# Altium project B108AA.PrjPcb (part 2 of 4)

## Sheet I2C Air Pressure Sensor.SchDoc: Air Pressure Sensor
size 292 x 193 mm; SheetNumber: 13; SheetTotal: 40
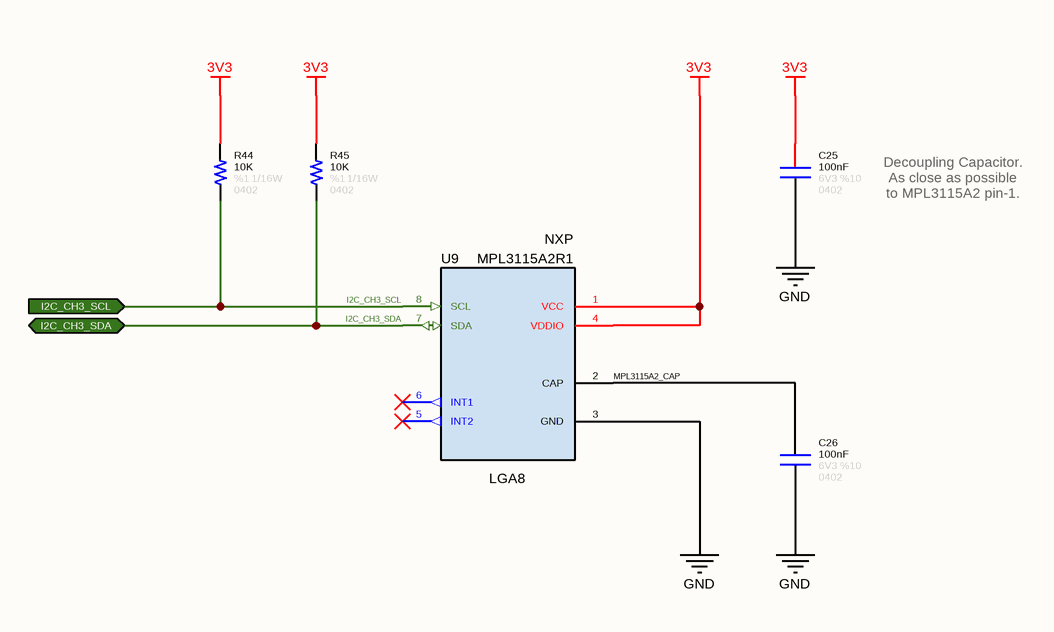
[diagram p12: I2C Air Pressure Sensor.SchDoc]

### Parts
C25  value 100nF  Tolerance: %10  Voltage: 6V3  Case: 0402  [CAPACITOR_0402]  (hidden comment: Capacitor - 100nF [0402] (Ceramic))
C26  value 100nF  Tolerance: %10  Voltage: 6V3  Case: 0402  [CAPACITOR_0402]  (hidden comment: Capacitor - 100nF [0402] (Ceramic))
R44  value 10K  Tolerance: %1  Case: 0402  Power: 1/16W  [RESISTOR_0402]  (hidden comment: 10K - 0402 - %1 - 1/16W)
R45  value 10K  Tolerance: %1  Case: 0402  Power: 1/16W  [RESISTOR_0402]  (hidden comment: 10K - 0402 - %1 - 1/16W)
U9  Manufacturer Name: NXP  Case: LGA8  [MPL3115A2]  (hidden comment: MPL3115A2R1)

### Ports
I2C_CH3_SCL (in), I2C_CH3_SDA (bidir)

### Nets
3V3: C25.2 R44.2 R45.2 U9.1(VCC) U9.4(VDDIO)
GND: C25.1 C26.1 U9.3(GND)
I2C_CH3_SCL: R44.1 U9.8(SCL) ; port I2C_CH3_SCL
I2C_CH3_SDA: R45.1 U9.7(SDA) ; port I2C_CH3_SDA
MPL3115A2_CAP: C26.2 U9.2(CAP)

Not connected (* = marked no-connect by the designer): U9 5(INT2)* 6(INT1)*

### Notes on the sheet
- Decoupling Capacitor. As close as possible to MPL3115A2 pin-1.
- © 2021 All rights reserved.
  This document may not, in whole or in part, be copied, photocopied, reproduced, translated or converted to any electronic or machine readable from without prior written permission of Mehmet Günce Akkoyun.
  Engineer contact : akkoyun@me.com
- Property of
- Engineer :
- Date :
- Size :
- A4
- Time :
- Project :
- Page :
- /
- Customer :
- Product ID :
- Module ID :
- Version :
- File :
- Revision :

### Library data of the parts
C25 C26 = Capacitor - 100nF [0402-6V3]: as C5 on sheet RS485 Channel 1; ComponentLink1Description: Mouser; ComponentLink1URL: https://www.mouser.com.tr/ProductDetail/AVX/04026D104KAT4A?qs=sGAEpiMZZMs0AnBnWHyRQPg4iYkCw7IMED%2F4kpqgf7w%3D; ComponentLink2Description: DataSheet; ComponentLink2URL: https://www.mouser.com.tr/datasheet/2/40/cx5r-776519.pdf
R44 R45 = Resistor - 10K [0402]: Thick Film Resistors - SMD 1/16 W 10 KOhm 1%; Manufacturer Name: Vishay; Manufacturer Part Number: CRCW040210K0FKED; ComponentLink1Description: DataSheet; ComponentLink1URL: https://www.mouser.com.tr/datasheet/2/427/dcrcwe3-1762152.pdf; ComponentLink2Description: Mouser; ComponentLink2URL: https://www.mouser.com.tr/ProductDetail/Vishay-Dale/CRCW040210K0FKED?qs=sGAEpiMZZMu61qfTUdNhG2DpbjADlD3GcalbOv9utCY%3D
U9 = IC - MPL3115A2R1: Board Mount Pressure Sensors; Operating Pressure: 20 kPa to 110 kPa; RoHS: Yes; Product Type: Absolute Pressure Sensors; Manufacturer Part Number: MPL3115A2R1

## Sheet I2C TH Sensor Socket.SchDoc: T/H Sensor Socket
size 292 x 193 mm; SheetNumber: 11; SheetTotal: 40
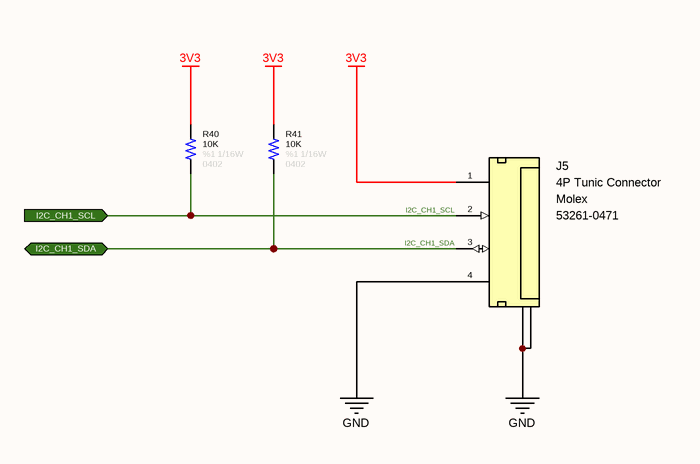
[diagram p13: I2C TH Sensor Socket.SchDoc]

### Parts
J5  Manufacturer Name: Molex  Manufacturer Part Number: 53261-0471  [Connector_Tunic 4P]  (hidden comment: 4P SMD Tunic Connector)
R40  value 10K  Tolerance: %1  Case: 0402  Power: 1/16W  [RESISTOR_0402]  (hidden comment: 10K - 0402 - %1 - 1/16W)
R41  value 10K  Tolerance: %1  Case: 0402  Power: 1/16W  [RESISTOR_0402]  (hidden comment: 10K - 0402 - %1 - 1/16W)

### Ports
I2C_CH1_SCL (in), I2C_CH1_SDA (bidir)

### Nets
3V3: J5.1(Pin-1) R40.2 R41.2
GND: J5.4(Pin-4) J5.5(GND) J5.6(GND)
I2C_CH1_SCL: J5.2(Pin-2) R40.1 ; port I2C_CH1_SCL
I2C_CH1_SDA: J5.3(Pin-3) R41.1 ; port I2C_CH1_SDA

### Notes on the sheet
- © 2021 All rights reserved.
  This document may not, in whole or in part, be copied, photocopied, reproduced, translated or converted to any electronic or machine readable from without prior written permission of Mehmet Günce Akkoyun.
  Engineer contact : akkoyun@me.com
- Property of
- Engineer :
- Date :
- Size :
- A4
- Time :
- Project :
- Page :
- /
- Customer :
- Product ID :
- Module ID :
- Version :
- File :
- Revision :
- (in symbol Connector - Mini Tunic 4P (1.25)) 4P Tunic Connector

### Library data of the parts
J5 = Connector - Mini Tunic 4P (1.25): Mini Tunic Connector with 4P; Pitch: 1.25mm; Position: 4; ROHS: Yes; ComponentLink1Description: DataSheet; ComponentLink1URL: https://www.mouser.com.tr/datasheet/2/276/0532610471_PCB_HEADERS-170942.pdf; ComponentLink2Description: Mouser; ComponentLink2URL: https://www.mouser.com.tr/ProductDetail/Molex/53261-0471?qs=%2Fha2pyFaduhLhIsk8tywtK7BwWtguBSP4XxyDBTOTfs%3D; Case: SMD; System: Connector
R40 R41 = Resistor - 10K [0402]: as R44 on sheet I2C Air Pressure Sensor; ComponentLink1Description: DataSheet; ComponentLink1URL: https://www.mouser.com.tr/datasheet/2/427/dcrcwe3-1762152.pdf; ComponentLink2Description: Mouser; ComponentLink2URL: https://www.mouser.com.tr/ProductDetail/Vishay-Dale/CRCW040210K0FKED?qs=sGAEpiMZZMu61qfTUdNhG2DpbjADlD3GcalbOv9utCY%3D

## Sheet I2C UV Sensor.SchDoc: UV Sensor
size 292 x 193 mm; SheetNumber: 12; SheetTotal: 40
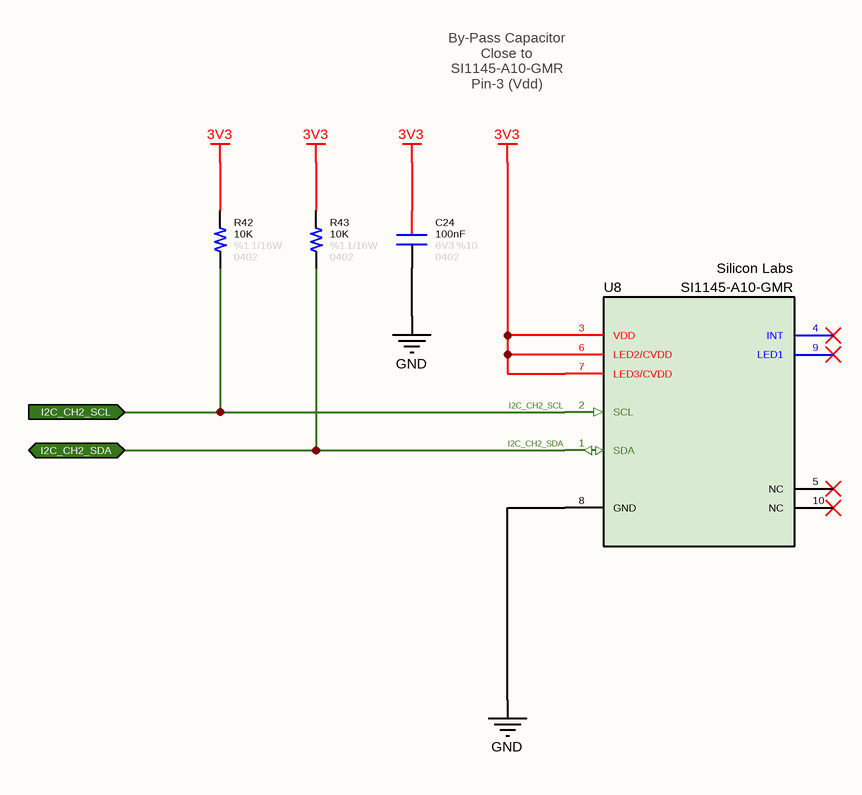
[diagram p14: I2C UV Sensor.SchDoc]

### Parts
C24  value 100nF  Tolerance: %10  Voltage: 6V3  Case: 0402  [CAPACITOR_0402]  (hidden comment: Capacitor - 100nF [0402] (Ceramic))
R42  value 10K  Tolerance: %1  Case: 0402  Power: 1/16W  [RESISTOR_0402]  (hidden comment: 10K - 0402 - %1 - 1/16W)
R43  value 10K  Tolerance: %1  Case: 0402  Power: 1/16W  [RESISTOR_0402]  (hidden comment: 10K - 0402 - %1 - 1/16W)
U8  Manufacturer Name: Silicon Labs  [SI1145]  (hidden comment: Si1145-A10-GMR)

### Ports
I2C_CH2_SCL (in), I2C_CH2_SDA (bidir)

### Nets
3V3: C24.2 R42.2 R43.2 U8.3(VDD) U8.6(LED2/CVDD) U8.7(LED3/CVDD)
GND: C24.1 U8.8(GND)
I2C_CH2_SCL: R42.1 U8.2(SCL) ; port I2C_CH2_SCL
I2C_CH2_SDA: R43.1 U8.1(SDA) ; port I2C_CH2_SDA

Not connected (* = marked no-connect by the designer): U8 4(INT)* 5(NC)* 9(LED1)* 10(NC)*

### Notes on the sheet
- By-Pass Capacitor
  Close to SI1145-A10-GMR
  Pin-3 (Vdd)
- © 2021 All rights reserved.
  This document may not, in whole or in part, be copied, photocopied, reproduced, translated or converted to any electronic or machine readable from without prior written permission of Mehmet Günce Akkoyun.
  Engineer contact : akkoyun@me.com
- Property of
- Engineer :
- Date :
- Size :
- A4
- Time :
- Project :
- Page :
- /
- Customer :
- Product ID :
- Module ID :
- Version :
- File :
- Revision :

### Library data of the parts
C24 = Capacitor - 100nF [0402-6V3]: as C5 on sheet RS485 Channel 1; ComponentLink1Description: Mouser; ComponentLink1URL: https://www.mouser.com.tr/ProductDetail/AVX/04026D104KAT4A?qs=sGAEpiMZZMs0AnBnWHyRQPg4iYkCw7IMED%2F4kpqgf7w%3D; ComponentLink2Description: DataSheet; ComponentLink2URL: https://www.mouser.com.tr/datasheet/2/40/cx5r-776519.pdf
R42 R43 = Resistor - 10K [0402]: as R44 on sheet I2C Air Pressure Sensor; ComponentLink1Description: DataSheet; ComponentLink1URL: https://www.mouser.com.tr/datasheet/2/427/dcrcwe3-1762152.pdf; ComponentLink2Description: Mouser; ComponentLink2URL: https://www.mouser.com.tr/ProductDetail/Vishay-Dale/CRCW040210K0FKED?qs=sGAEpiMZZMu61qfTUdNhG2DpbjADlD3GcalbOv9utCY%3D
U8 = IC - Si1145-A10-GMR: Proximity Sensors I2C UV Index and Proximity/Ambient Light Sensor with 1 LED Driver; Case: QFN-10; RoHS: Yes; Manufacturer Part Number: SI1145-A10-GMR

## Sheet I2C Serial ID.SchDoc: Serial ID
size 292 x 193 mm; SheetNumber: 10; SheetTotal: 40
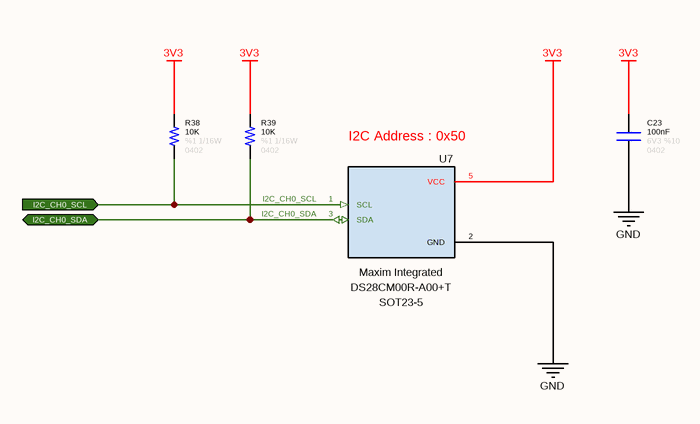
[diagram p15: I2C Serial ID.SchDoc]

### Parts
C23  value 100nF  Tolerance: %10  Voltage: 6V3  Case: 0402  [CAPACITOR_0402]  (hidden comment: Capacitor - 100nF [0402] (Ceramic))
R38  value 10K  Tolerance: %1  Case: 0402  Power: 1/16W  [RESISTOR_0402]  (hidden comment: 10K - 0402 - %1 - 1/16W)
R39  value 10K  Tolerance: %1  Case: 0402  Power: 1/16W  [RESISTOR_0402]  (hidden comment: 10K - 0402 - %1 - 1/16W)
U7  Manufacturer Name: Maxim Integrated  Case: SOT23-5  [SOT-23-5]  (hidden comment: DS28CM00R-A00+T)

### Ports
I2C_CH0_SCL (in), I2C_CH0_SDA (bidir)

### Nets
3V3: C23.2 R38.2 R39.2 U7.5(VCC)
GND: C23.1 U7.2(GND)
I2C_CH0_SCL: R38.1 U7.1(SCL) ; port I2C_CH0_SCL
I2C_CH0_SDA: R39.1 U7.3(SDA) ; port I2C_CH0_SDA

Not connected (* = marked no-connect by the designer): U7 4(NC)

### Notes on the sheet
- (near U7) I2C Address : 0x50
- © 2021 All rights reserved.
  This document may not, in whole or in part, be copied, photocopied, reproduced, translated or converted to any electronic or machine readable from without prior written permission of Mehmet Günce Akkoyun.
  Engineer contact : akkoyun@me.com
- Property of
- Engineer :
- Date :
- Size :
- A4
- Time :
- Project :
- Page :
- /
- Customer :
- Product ID :
- Module ID :
- Version :
- File :
- Revision :

### Library data of the parts
C23 = Capacitor - 100nF [0402-6V3]: as C5 on sheet RS485 Channel 1; ComponentLink1Description: Mouser; ComponentLink1URL: https://www.mouser.com.tr/ProductDetail/AVX/04026D104KAT4A?qs=sGAEpiMZZMs0AnBnWHyRQPg4iYkCw7IMED%2F4kpqgf7w%3D; ComponentLink2Description: DataSheet; ComponentLink2URL: https://www.mouser.com.tr/datasheet/2/40/cx5r-776519.pdf
R38 R39 = Resistor - 10K [0402]: as R44 on sheet I2C Air Pressure Sensor; ComponentLink1Description: DataSheet; ComponentLink1URL: https://www.mouser.com.tr/datasheet/2/427/dcrcwe3-1762152.pdf; ComponentLink2Description: Mouser; ComponentLink2URL: https://www.mouser.com.tr/ProductDetail/Vishay-Dale/CRCW040210K0FKED?qs=sGAEpiMZZMu61qfTUdNhG2DpbjADlD3GcalbOv9utCY%3D
U7 = IC - DS28C: Security ICs / Authentication ICs I C/SMBus Silicon Serial Number; Data Bus Width: 64 bit; RoHS: Yes; Product Type: Security ICs; Manufacturer Part Number: DS28CM00R-A00+T

## Sheet Power Architechture.SchDoc: Power Block Diagram
size 292 x 193 mm; SheetNumber: 2; SheetTotal: 40
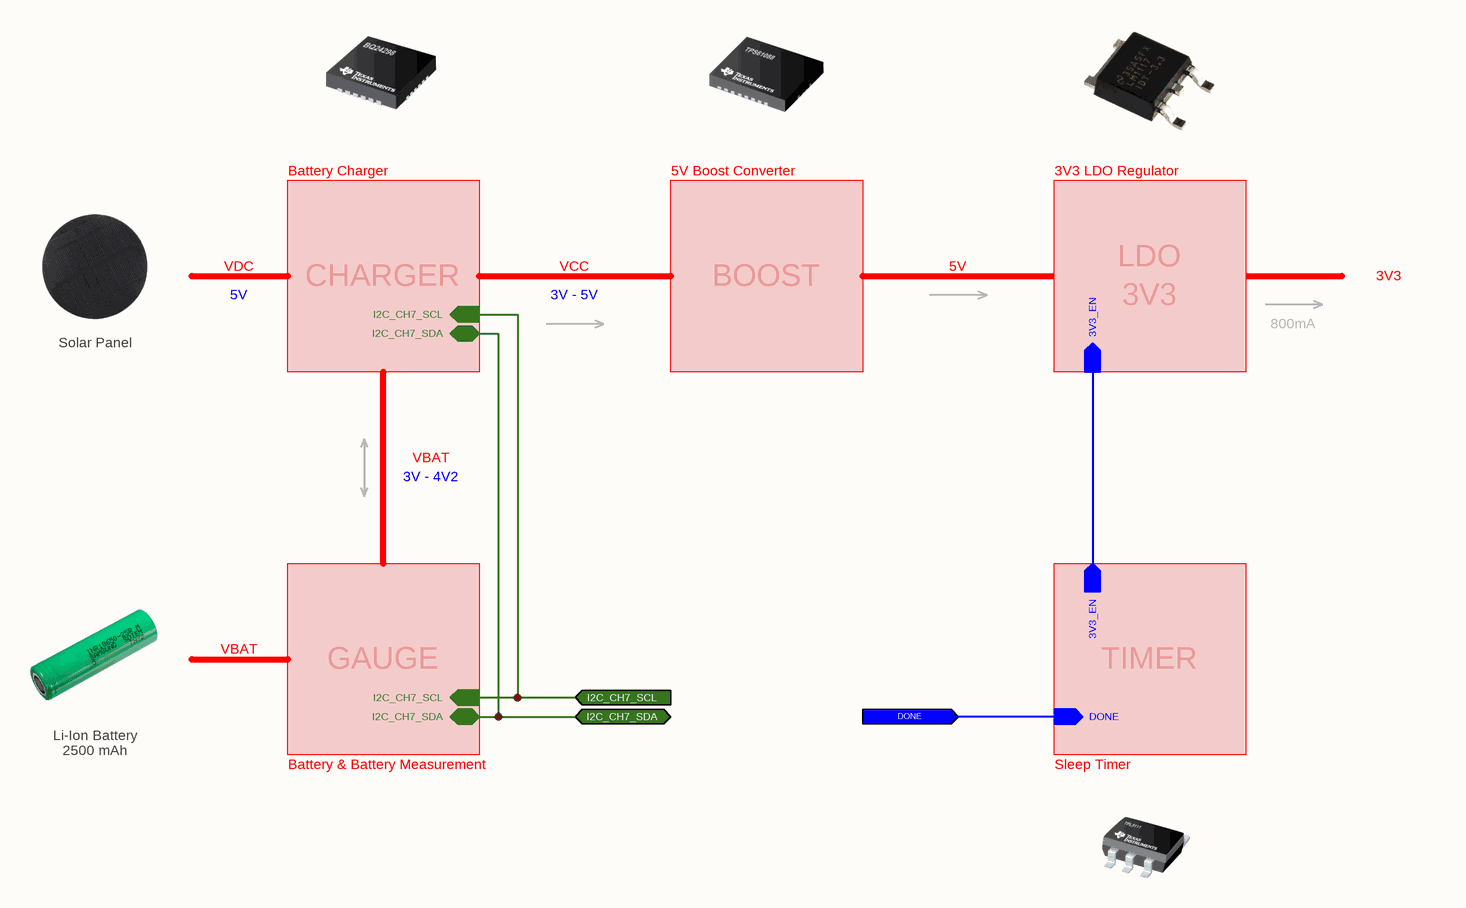
[diagram p16: Power Architechture.SchDoc]

### Sub-sheets
3V3 LDO Regulator = Power 3V3 Regulator.SchDoc: 3V3_EN (in)
5V Boost Converter = Power 5V Boost Converter.SchDoc: no entries
Battery & Battery Measurement = Power Battery Measurement.SchDoc: I2C_CH7_SCL (in), I2C_CH7_SDA (bidir)
Battery Charger = Power Battery Charger.SchDoc: I2C_CH7_SDA (bidir), I2C_CH7_SCL (in)
Sleep Timer = Power Sleep Timer.SchDoc: 3V3_EN (out), DONE (in)

### Ports
DONE (in), I2C_CH7_SCL (in), I2C_CH7_SDA (bidir)

### Nets
3V3_EN: sheet 3V3 LDO Regulator/3V3_EN, sheet Sleep Timer/3V3_EN
DONE: port DONE, sheet Sleep Timer/DONE
I2C_CH7_SCL: port I2C_CH7_SCL, sheet Battery & Battery Measurement/I2C_CH7_SCL, sheet Battery Charger/I2C_CH7_SCL
I2C_CH7_SDA: port I2C_CH7_SDA, sheet Battery & Battery Measurement/I2C_CH7_SDA, sheet Battery Charger/I2C_CH7_SDA

### Notes on the sheet
- VDC
- 5V
- CHARGER
- VCC
- 3V - 5V
- BOOST
- LDO
- 3V3
- Solar Panel
- 800mA
- VBAT
- 3V - 4V2
- GAUGE
- TIMER
- Li-Ion Battery
  2500 mAh
- © 2021 All rights reserved.
  This document may not, in whole or in part, be copied, photocopied, reproduced, translated or converted to any electronic or machine readable from without prior written permission of Mehmet Günce Akkoyun.
  Engineer contact : akkoyun@me.com
- Property of
- Engineer :
- Date :
- Size :
- A4
- Time :
- Project :
- Page :
- /
- Customer :
- Product ID :
- Module ID :
- Version :
- File :
- Revision :

## Sheet Power Battery Measurement.SchDoc: Battery Measurement
size 292 x 193 mm; DocumentNumber: 3; SheetNumber: 3; SheetTotal: 40
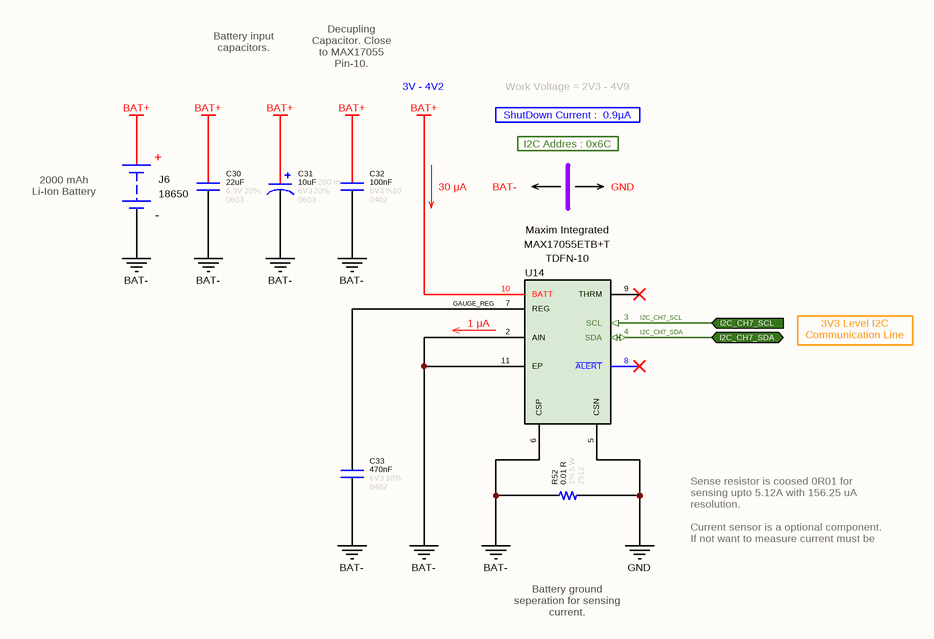
[diagram p17: Power Battery Measurement.SchDoc]

### Parts
C30  value 22uF  Tolerance: 20%  Case: 0603  Voltage: 6.3V  [CAPACITOR_0603]  (hidden comment: Capacitor - 22uF [0603] (Ceramic))
C31  value 10uF  ESR: 200 m  Tolerance: 20%  Case: 0603  Voltage: 6V3  [CAPACITOR_0603_Tantalum]  (hidden comment: Capacitor - 10uF [0603] (Tantalum))
C32  value 100nF  Tolerance: %10  Voltage: 6V3  Case: 0402  [CAPACITOR_0402]  (hidden comment: Capacitor - 100nF [0402] (Ceramic))
C33  value 470nF  Tolerance: 10%  Case: 0402  Voltage: 6V3  [CAPACITOR_0402]  (hidden comment: Capacitor - 470nF [0402] (Ceramic))
J6  Battery Size: 18650  [BATTERY_HOLDER - Bat - V2]  (hidden comment: 54)
R52  value 0.01 R  Tolerance: 1%  Power: 5 W  Case: 2512  [RESISTOR_2512 SHUNT]  (hidden comment: 0R01 - 2512 - %1 - 5W)
U14  Manufacturer Name: Maxim Integrated  [TDFN-10]  (hidden comment: MAX17055ETB+T)

### Ports
I2C_CH7_SCL (in), I2C_CH7_SDA (bidir)

### Nets
BAT+: C30.2 C31.1 C32.2 J6.1(BAT+) U14.10(BATT)
BAT-: C30.1 C31.2 C32.1 C33.1 J6.2(BAT-) R52.2 U14.2(AIN) U14.6(CSP) U14.11(EP)
GND: R52.1 U14.5(CSN)
GAUGE_REG: C33.2 U14.7(REG)
I2C_CH7_SCL: U14.3(SCL) ; port I2C_CH7_SCL
I2C_CH7_SDA: U14.4(SDA) ; port I2C_CH7_SDA

Not connected (* = marked no-connect by the designer): U14 8(~{ALERT})* 9(THRM)*

### Notes on the sheet
- Battery input capacitors.
- Decupling Capacitor. Close to MAX17055 Pin-10.
- 3V - 4V2
- ShutDown Current :  0.9µA
- Work Voltage = 2V3 - 4V9
- (near J6) 2000 mAh
  Li-Ion Battery
- 30 μA
- I2C Addres : 0x6C
- BAT-
- GND
- (near U14) 1 μA
- 3V3 Level I2C
  Communication Line
- Sense resistor is coosed 0R01 for sensing upto 5.12A with 156.25 uA resolution.
  Current sensor is a optional component. If not want to measure current must be connect PACK- to GND.
- Battery ground seperation for sensing current.
- © 2021 All rights reserved.
  This document may not, in whole or in part, be copied, photocopied, reproduced, translated or converted to any electronic or machine readable from without prior written permission of Mehmet Günce Akkoyun.
  Engineer contact : akkoyun@me.com
- Property of
- Engineer :
- Date :
- Size :
- A4
- Time :
- Project :
- Page :
- /
- Customer :
- Product ID :
- Module ID :
- Version :
- File :
- Revision :
- (in symbol Connector - 18650 Battery Holder 2) +; -

### Library data of the parts
C30 = Capacitor - 22uF [0603-6V3]: Multilayer Ceramic Capacitors - SMD - 6V3 22uF X5R 0603 20%; Manufacturer Part Number: GRM188R60J226MEA0D; Manufacturer Name: Murata
C31 = Capacitor - 10uF [0603-6V3] (Tantalium): Capacitor - 10uF [0603] (Tantalium); Manufacturer Name: AVX; Manufacturer Part Number: F380J106MMAAH3; ComponentLink1Description: DataSheet; ComponentLink1URL: https://www.mouser.com.tr/datasheet/2/40/f38-775706.pdf; ComponentLink2Description: Mouser; ComponentLink2URL: https://www.mouser.com.tr/ProductDetail/AVX/F380J106MMAAH3?qs=sGAEpiMZZMtZ1n0r9vR22fixilZl6Mr8zRKleESmvcDFwZ4LSyC6Pg%3D%3D
C32 = Capacitor - 100nF [0402-6V3]: as C5 on sheet RS485 Channel 1; ComponentLink1Description: Mouser; ComponentLink1URL: https://www.mouser.com.tr/ProductDetail/AVX/04026D104KAT4A?qs=sGAEpiMZZMs0AnBnWHyRQPg4iYkCw7IMED%2F4kpqgf7w%3D; ComponentLink2Description: DataSheet; ComponentLink2URL: https://www.mouser.com.tr/datasheet/2/40/cx5r-776519.pdf
C33 = Capacitor - 470 nF [0402-6V3]: Multilayer Ceramic Capacitors - SMD - 6.3V 470nF X7R 0402 10%; Manufacturer Name: AVX; Manufacturer Part Number: 04026C474KAT2A
J6 = Connector - 18650 Battery Holder 2: BATTERY CONTACT CLP 18650 PC PIN; Manufacturer Name: Keystone Electronics; Manufacturer Part Number: 54; Product Type: Battery Holders; RoHS: Yes
R52 = Resistor - 0R01 [2512]: Shunt Resistors - SMD 5 W 0.01 Ohm 1%; Manufacturer Part Number: TLRH3APTTE10L0F; Manufacturer Name: KOA Speer
U14 = IC - MAX17055: IC FUEL GAUGE MODELGAUGE 10TDFN; Minimum Operating Temperature: - 40 C; Product Type: Battery Gauge; Maximum Operating Temperature: + 85 C; Manufacturer Part Number: MAX17055ETB+T; Case: TDFN-10

## Sheet Power Battery Charger.SchDoc: Battery Charger
size 292 x 193 mm; DocumentNumber: 4; SheetNumber: 4; SheetTotal: 40
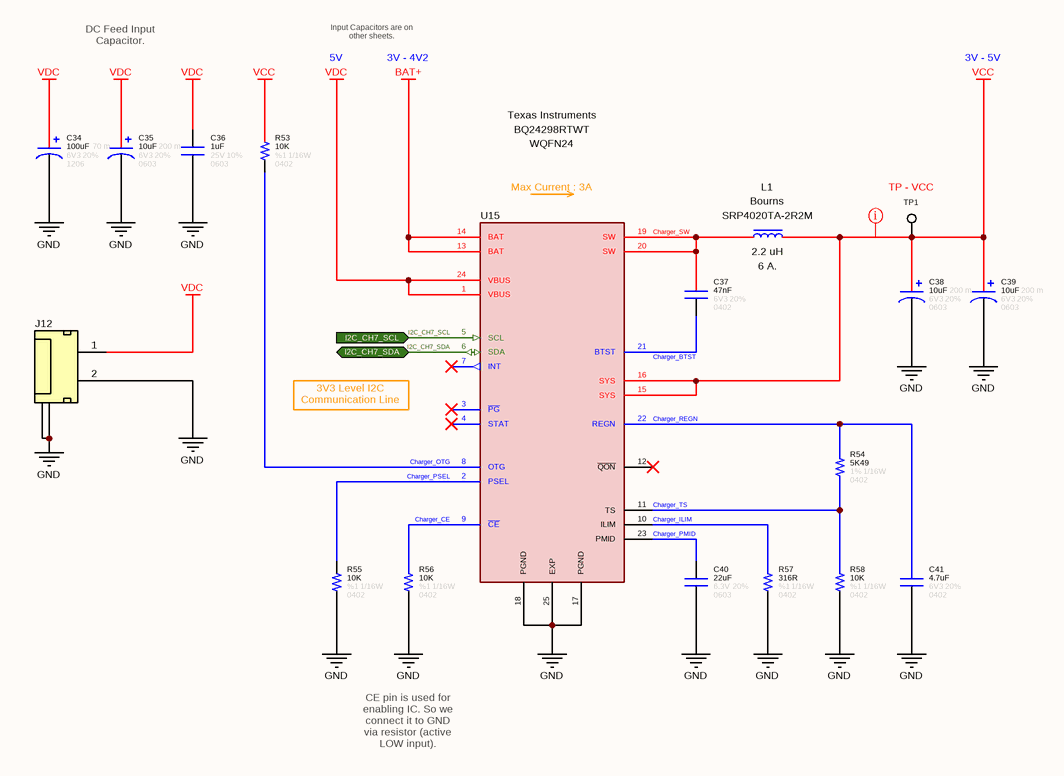
[diagram p18: Power Battery Charger.SchDoc]

### Parts
C34  value 100uF  ESR: 70 m  Tolerance: 20%  Case: 1206  Voltage: 6V3  [CAPACITOR_0603_Tantalum]  (hidden comment: Capacitor - 100uF [1206] (Tantalum))
C35  value 10uF  ESR: 200 m  Tolerance: 20%  Case: 0603  Voltage: 6V3  [CAPACITOR_0603_Tantalum]  (hidden comment: Capacitor - 10uF [0603] (Tantalum))
C36  value 1uF  Tolerance: 10%  Case: 0603  Voltage: 25V  [CAPACITOR_0603]  (hidden comment: Capacitor - 1uF [0603] (Ceramic))
C37  value 47nF  Tolerance: 20%  Case: 0402  Voltage: 6V3  [CAPACITOR_0402]  (hidden comment: Capacitor - 47nF [0402] (Ceramic))
C38  value 10uF  ESR: 200 m  Tolerance: 20%  Case: 0603  Voltage: 6V3  [CAPACITOR_0603_Tantalum]  (hidden comment: Capacitor - 10uF [0603] (Tantalum))
C39  value 10uF  ESR: 200 m  Tolerance: 20%  Case: 0603  Voltage: 6V3  [CAPACITOR_0603_Tantalum]  (hidden comment: Capacitor - 10uF [0603] (Tantalum))
C40  value 22uF  Tolerance: 20%  Case: 0603  Voltage: 6.3V  [CAPACITOR_0603]  (hidden comment: Capacitor - 22uF [0603] (Ceramic))
C41  value 4.7uF  Tolerance: 20%  Case: 0402  Voltage: 6V3  [CAPACITOR_0402]  (hidden comment: Capacitor - 4.7uF [0402] (Ceramic))
J12  2P SMD Tunic Connector  [Connector_Tunic 2P]  (value not drawn)
L1  value 2.2 uH  Manufacturer Name: Bourns  Maximum DC Current: 6 A.  [SRP4020TA]  (hidden comment: SRP4020TA-2R2M)
R53  value 10K  Tolerance: %1  Case: 0402  Power: 1/16W  [RESISTOR_0402]  (hidden comment: 10K - 0402 - %1 - 1/16W)
R54  value 5K49  Power: 1/16W  Case: 0402  Tolerance: 1%  [RESISTOR_0402]  (hidden comment: 5K49 - 0402 - %1 - 1/16W)
R55  value 10K  Tolerance: %1  Case: 0402  Power: 1/16W  [RESISTOR_0402]  (hidden comment: 10K - 0402 - %1 - 1/16W)
R56  value 10K  Tolerance: %1  Case: 0402  Power: 1/16W  [RESISTOR_0402]  (hidden comment: 10K - 0402 - %1 - 1/16W)
R57  value 316R  Power: 1/16W  Case: 0402  Tolerance: %1  [RESISTOR_0402]  (hidden comment: 316R - 0402 - %1 - 1/16W)
R58  value 10K  Tolerance: %1  Case: 0402  Power: 1/16W  [RESISTOR_0402]  (hidden comment: 10K - 0402 - %1 - 1/16W)
TP1  TP - VCC  [TP]  (no BOM)
U15  Manufacturer Name: Texas Instruments  Case: WQFN24  [WQFN-24]  (hidden comment: BQ24298RTWT)

### Ports
I2C_CH7_SCL (in), I2C_CH7_SDA (bidir)

### Nets
BAT+: U15.13(BAT) U15.14(BAT)
GND: C34.2 C35.2 C36.1 C38.2 C39.2 C40.1 C41.1 J12.2(Pin2) J12.3(GND) J12.4(GND) R55.1 R56.1 R57.1 R58.1 U15.17(PGND) U15.18(PGND) U15.25(EXP)
VCC: C38.1 C39.1 L1.2 R53.2 TP1.1 U15.15(SYS) U15.16(SYS)
VDC: C34.1 C35.1 C36.2 J12.1(Pin1) U15.1(VBUS) U15.24(VBUS)
Charger_BTST: C37.1 U15.21(BTST)
Charger_CE: R56.2 U15.9(~{CE})
Charger_ILIM: R57.2 U15.10(ILIM)
Charger_OTG: R53.1 U15.8(OTG)
Charger_PMID: C40.2 U15.23(PMID)
Charger_PSEL: R55.2 U15.2(PSEL)
Charger_REGN: C41.2 R54.2 U15.22(REGN)
Charger_SW: C37.2 L1.1 U15.19(SW) U15.20(SW)
Charger_TS: R54.1 R58.2 U15.11(TS)
I2C_CH7_SCL: U15.5(SCL) ; port I2C_CH7_SCL
I2C_CH7_SDA: U15.6(SDA) ; port I2C_CH7_SDA

Not connected (* = marked no-connect by the designer): U15 3(~{PG})* 4(STAT)* 7(INT)* 12(~{QON})*

### Layout directives
rule Supply Nets [Voltage = 3.000]: VCC

### Notes on the sheet
- DC Feed Input Capacitor.
- 5V
- Input Capacitors are on other sheets.
- 3V - 4V2
- 3V - 5V
- 3V3 Level I2C
  Communication Line
- CE pin is used for enabling IC. So we connect it to GND via resistor (active LOW input).
- © 2021 All rights reserved.
  This document may not, in whole or in part, be copied, photocopied, reproduced, translated or converted to any electronic or machine readable from without prior written permission of Mehmet Günce Akkoyun.
  Engineer contact : akkoyun@me.com
- Property of
- Engineer :
- Date :
- Size :
- A4
- Time :
- Project :
- Page :
- /
- Customer :
- Product ID :
- Module ID :
- Version :
- File :
- Revision :
- (in symbol IC - BQ24298RTWT) Max Current : 3A

### Library data of the parts
C34 = Capacitor - 100uF [1206-6V3] (Tantalium): Tantalum Capacitors - Polymer 6.3V 100uF 1206 20% ESR=70mOhms; Manufacturer Name: KEMET; Manufacturer Part Number: T527I107M006ATE070
C35 C38 C39 = Capacitor - 10uF [0603-6V3] (Tantalium): as C31 on sheet Power Battery Measurement; ComponentLink1Description: DataSheet; ComponentLink1URL: https://www.mouser.com.tr/datasheet/2/40/f38-775706.pdf; ComponentLink2Description: Mouser; ComponentLink2URL: https://www.mouser.com.tr/ProductDetail/AVX/F380J106MMAAH3?qs=sGAEpiMZZMtZ1n0r9vR22fixilZl6Mr8zRKleESmvcDFwZ4LSyC6Pg%3D%3D
C36 = Capacitor - 1uF [0603-25V]: Multilayer Ceramic Capacitors - SMD - 25V 1uF X7R 0603 10%; Manufacturer Part Number: GCJ188R71E105KA01D; Manufacturer Name: Murata
C37 = Capacitor - 47nF [0402-6V3]: Multilayer Ceramic Capacitors - SMD - 6.3V 47nF X7R 0402 10%; Manufacturer Name: AVX; Manufacturer Part Number: 04026C472MAT2A
C40 = Capacitor - 22uF [0603-6V3]: as C30 on sheet Power Battery Measurement
C41 = Capacitor - 4.7uF [0402-6V3]: Multilayer Ceramic Capacitors - SMD - 6V3 4.7uF X5R 0402 20%; Manufacturer Part Number: C0402C475M9PACTU; Manufacturer Name: KEMET
J12 = Connector - Mini Tunic 2P (1.25): Mini Tunic Connector with 2P; Manufacturer Name: Molex; Manufacturer Part Number: 53261-0271; Height: 3.55mm; Mouser Part Number: 538-53261-0271; ROHS: Yes; System: Connector
L1 = Inductor - SRP4020TA-2R2M: 6 A. 2.2uH Power inducator, 20% tol, SMD, RoHS; Maximum DC Resistance: 61 mOhms; Core Material: Carbonyl Powder; Maximum Operating Temperature: +150 C; ROHS: Yes; Tolerance: 20%; Minimum Operating Temperature: -40 C; Height: 1.8mm; Product Type: Fixed Inductors; Case: SMD; Manufacturer Part Number: SRP4020TA-2R2M
R53 R55 R56 R58 = Resistor - 10K [0402]: as R44 on sheet I2C Air Pressure Sensor; ComponentLink1Description: DataSheet; ComponentLink1URL: https://www.mouser.com.tr/datasheet/2/427/dcrcwe3-1762152.pdf; ComponentLink2Description: Mouser; ComponentLink2URL: https://www.mouser.com.tr/ProductDetail/Vishay-Dale/CRCW040210K0FKED?qs=sGAEpiMZZMu61qfTUdNhG2DpbjADlD3GcalbOv9utCY%3D
R54 = Resistor - 5K49 [0402]: Thick Film Resistors - SMD 1/16 W 5.49 KOhm 1%; Manufacturer Name: Vishay; Manufacturer Part Number: CRCW04025K49FKED
R57 = Resistor - 316R [0402]: Thick Film Resistors - SMD 1/16 W 316 Ohm 1%; Manufacturer Name: Vishay; Manufacturer Part Number: CRCW0402316RFKED
TP1 = PCB - Test Point: Test Point
U15 = IC - BQ24298RTWT: I2C Controlled 3A Single Cell Charger; Operating Supply Current: 3 A.; Maximum Operating Temperature: +85; Minimum Operating Temperature: -40; ROHS: Yes; Product Type: Charge Management IC; Manufacturer Part Number: BQ24298RTWT

## Sheet Power 5V Boost Converter.SchDoc: 5V Buck/Boost Converter
size 292 x 193 mm; SheetNumber: 5; SheetTotal: 40
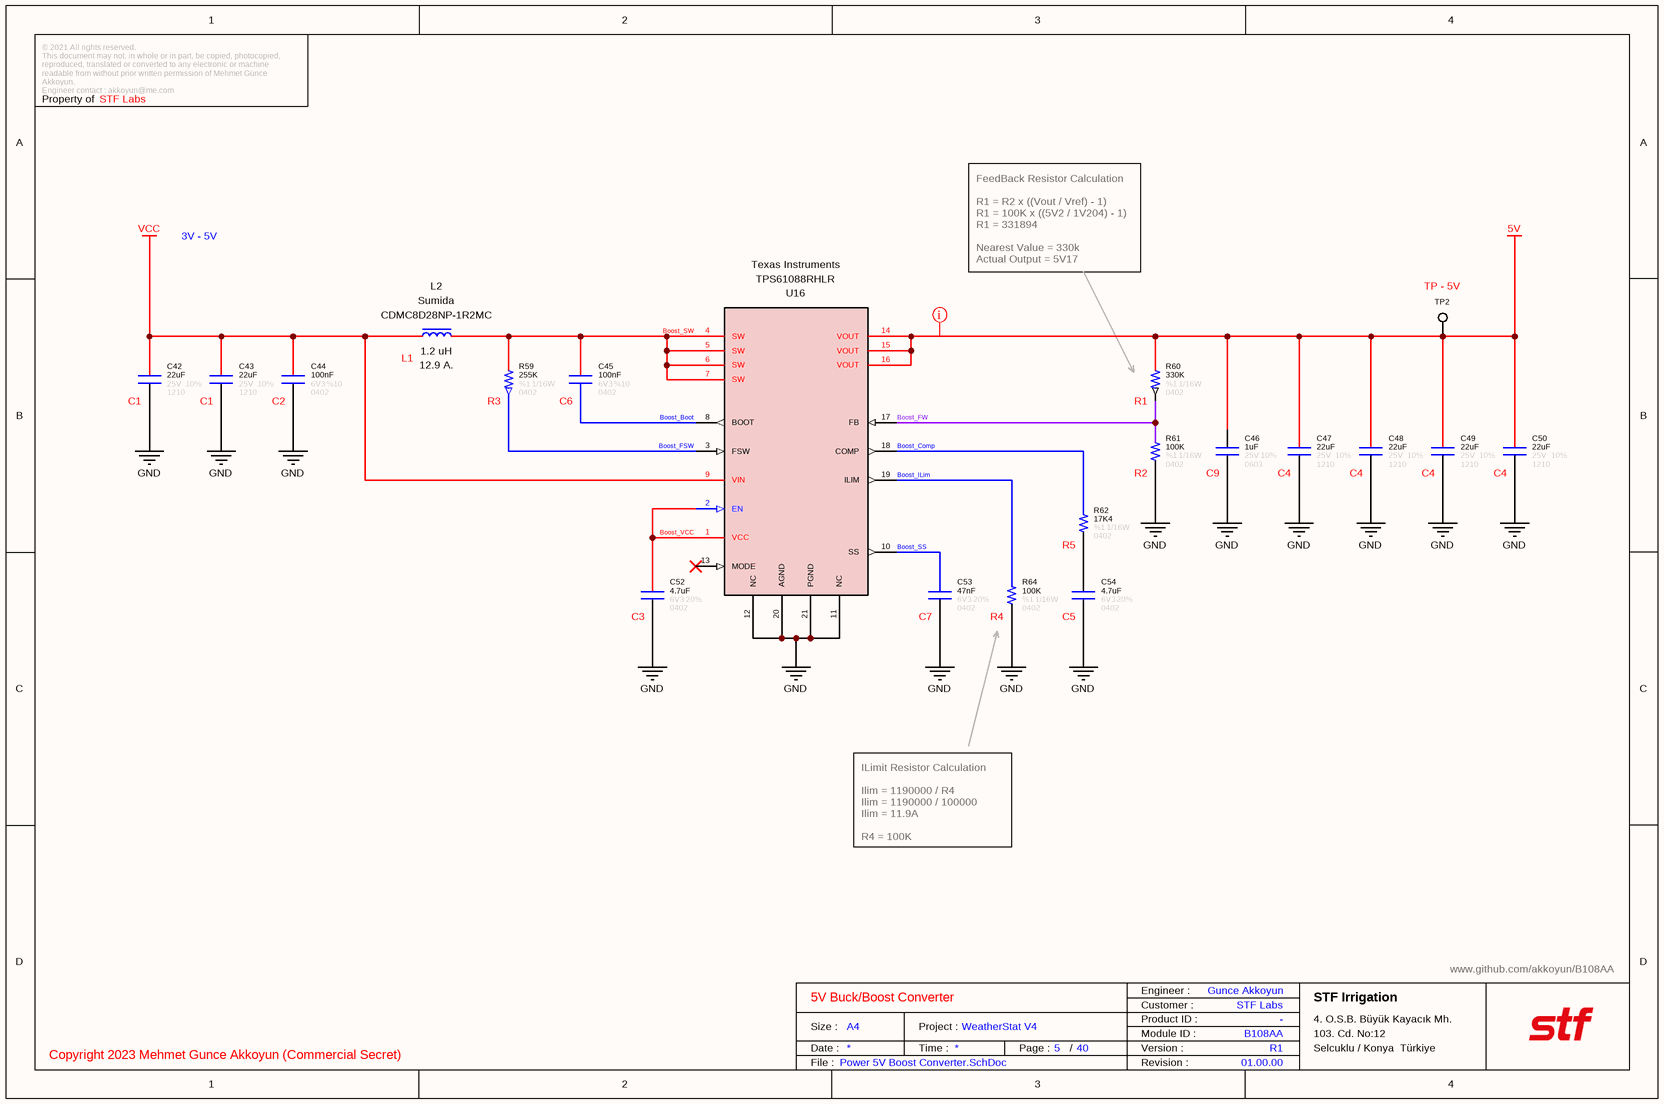
[diagram p19: Power 5V Boost Converter.SchDoc]

### Parts
C42  value 22uF  Tolerance: 10%  Case: 1210  Voltage: 25V  [CAPACITOR_0603]  (hidden comment: Capacitor - 22uF [1210] (Ceramic))
C43  value 22uF  Tolerance: 10%  Case: 1210  Voltage: 25V  [CAPACITOR_0603]  (hidden comment: Capacitor - 22uF [1210] (Ceramic))
C44  value 100nF  Tolerance: %10  Voltage: 6V3  Case: 0402  [CAPACITOR_0402]  (hidden comment: Capacitor - 100nF [0402] (Ceramic))
C45  value 100nF  Tolerance: %10  Voltage: 6V3  Case: 0402  [CAPACITOR_0402]  (hidden comment: Capacitor - 100nF [0402] (Ceramic))
C46  value 1uF  Tolerance: 10%  Case: 0603  Voltage: 25V  [CAPACITOR_0603]  (hidden comment: Capacitor - 1uF [0603] (Ceramic))
C47  value 22uF  Tolerance: 10%  Case: 1210  Voltage: 25V  [CAPACITOR_0603]  (hidden comment: Capacitor - 22uF [1210] (Ceramic))
C48  value 22uF  Tolerance: 10%  Case: 1210  Voltage: 25V  [CAPACITOR_0603]  (hidden comment: Capacitor - 22uF [1210] (Ceramic))
C49  value 22uF  Tolerance: 10%  Case: 1210  Voltage: 25V  [CAPACITOR_0603]  (hidden comment: Capacitor - 22uF [1210] (Ceramic))
C50  value 22uF  Tolerance: 10%  Case: 1210  Voltage: 25V  [CAPACITOR_0603]  (hidden comment: Capacitor - 22uF [1210] (Ceramic))
C52  value 4.7uF  Tolerance: 20%  Case: 0402  Voltage: 6V3  [CAPACITOR_0402]  (hidden comment: Capacitor - 4.7uF [0402] (Ceramic))
C53  value 47nF  Tolerance: 20%  Case: 0402  Voltage: 6V3  [CAPACITOR_0402]  (hidden comment: Capacitor - 47nF [0402] (Ceramic))
C54  value 4.7uF  Tolerance: 20%  Case: 0402  Voltage: 6V3  [CAPACITOR_0402]  (hidden comment: Capacitor - 4.7uF [0402] (Ceramic))
L2  value 1.2 uH  Manufacturer Name: Sumida  Maximum DC Current: 12.9 A.  [SRP4020TA]  (hidden comment: CDMC8D28NP-1R2MC)
R59  value 255K  Power: 1/16W  Case: 0402  Tolerance: %1  [RESISTOR_0402]  (hidden comment: 255K - 0402 - %1 - 1/16W)
R60  value 330K  Tolerance: %1  Case: 0402  Power: 1/16W  [RESISTOR_0402]  (hidden comment: 330K - 0402 - %1 - 1/16W)
R61  value 100K  Tolerance: %1  Case: 0402  Power: 1/16W  [RESISTOR_0402]  (hidden comment: 100K - 0402 - %1 - 1/16W)
R62  value 17K4  Tolerance: %1  Case: 0402  Power: 1/16W  [RESISTOR_0402]  (hidden comment: 17K4 - 0402 - %1 - 1/16W)
R64  value 100K  Tolerance: %1  Case: 0402  Power: 1/16W  [RESISTOR_0402]  (hidden comment: 100K - 0402 - %1 - 1/16W)
TP2  TP - 5V  [TP]  (no BOM)
U16  Manufacturer Name: Texas Instruments  [VQFN-20]  (hidden comment: TPS61088RHLR)

### Nets
5V: C46.2 C47.2 C48.2 C49.2 C50.2 R60.2 TP2.1 U16.14(VOUT) U16.15(VOUT) U16.16(VOUT)
GND: C42.1 C43.1 C44.1 C46.1 C47.1 C48.1 C49.1 C50.1 C52.1 C53.1 C54.1 R61.1 R64.1 U16.11(NC) U16.12(NC) U16.20(AGND) U16.21(PGND)
VCC: C42.2 C43.2 C44.2 L2.1 U16.9(VIN)
Boost_Boot: C45.1 U16.8(BOOT)
Boost_Comp: R62.2 U16.18(COMP)
Boost_FSW: R59.1 U16.3(FSW)
Boost_FW: R60.1 R61.2 U16.17(FB)
Boost_ILim: R64.2 U16.19(ILIM)
Boost_SS: C53.2 U16.10(SS)
Boost_SW: C45.2 L2.2 R59.2 U16.4(SW) U16.5(SW) U16.6(SW) U16.7(SW)
Boost_VCC: C52.2 U16.1(VCC) U16.2(EN)
NetC54_2: C54.2 R62.1

Not connected (* = marked no-connect by the designer): U16 13(MODE)*

### Layout directives
rule Supply Nets [Voltage = 5.170]: 5V

### Notes on the sheet
- 3V - 5V
- FeedBack Resistor Calculation
  R1 = R2 x ((Vout / Vref) - 1)
  R1 = 100K x ((5V2 / 1V204) - 1)
  R1 = 331894
  Nearest Value = 330k
  Actual Output = 5V17
- (near C42) C1
- (near C43) C1
- (near C44) C2
- (near L2) L1
- (near R59) R3
- (near C45) C6
- (near R60) R1
- (near R61) R2
- (near C46) C9
- (near C47) C4
- (near C48) C4
- (near C49) C4
- (near C50) C4
- (near R62) R5
- (near C52) C3
- (near C53) C7
- (near R64) R4
- (near C54) C5
- ILimit Resistor Calculation
  Ilim = 1190000 / R4
  Ilim = 1190000 / 100000
  Ilim = 11.9A
  R4 = 100K
- © 2021 All rights reserved.
  This document may not, in whole or in part, be copied, photocopied, reproduced, translated or converted to any electronic or machine readable from without prior written permission of Mehmet Günce Akkoyun.
  Engineer contact : akkoyun@me.com
- Property of
- Engineer :
- Date :
- Size :
- A4
- Time :
- Project :
- Page :
- /
- Customer :
- Product ID :
- Module ID :
- Version :
- File :
- Revision :

### Library data of the parts
C42 C43 C47-C50 = Capacitor - 22uF [1210-6V3]: Multilayer Ceramic Capacitors MLCC - SMD/SMT 22UF 25V 10% 1210; Manufacturer Part Number: GRM32ER71E226KE15L; Manufacturer Name: Murata
C44 C45 = Capacitor - 100nF [0402-6V3]: Capacitor - 100nF [0402-6V3] (Ceramic); Manufacturer Name: AVX; Manufacturer Part Number: 04026D104KAT4A; ComponentLink1Description: Mouser; ComponentLink1URL: https://www.mouser.com.tr/ProductDetail/AVX/04026D104KAT4A?qs=sGAEpiMZZMs0AnBnWHyRQPg4iYkCw7IMED%2F4kpqgf7w%3D; ComponentLink2Description: DataSheet; ComponentLink2URL: https://www.mouser.com.tr/datasheet/2/40/cx5r-776519.pdf
C46 = Capacitor - 1uF [0603-25V]: Multilayer Ceramic Capacitors - SMD - 25V 1uF X7R 0603 10%; Manufacturer Part Number: GCJ188R71E105KA01D; Manufacturer Name: Murata
C52 C54 = Capacitor - 4.7uF [0402-6V3]: Multilayer Ceramic Capacitors - SMD - 6V3 4.7uF X5R 0402 20%; Manufacturer Part Number: C0402C475M9PACTU; Manufacturer Name: KEMET
C53 = Capacitor - 47nF [0402-6V3]: Multilayer Ceramic Capacitors - SMD - 6.3V 47nF X7R 0402 10%; Manufacturer Name: AVX; Manufacturer Part Number: 04026C472MAT2A
L2 = Inductor - CDMC8D28NP-1R2MC: Power Inductors - SMD SMD Power Inductor 1.2UH 12.9A; Maximum DC Resistance: 7 mOhms; Tolerance: 20%; Core Material: Metal Composite; Maximum Operating Temperature: +125 C; ROHS: Yes; Minimum Operating Temperature: -40 C; Height: 3mm; Product Type: Power Inductor; Case: SMD; Manufacturer Part Number: CDMC8D28NP-1R2MC
R59 = Resistor - 255K [0402]: Thick Film Resistors - SMD 1/16 W 255 KOhm 1%; Manufacturer Name: Vishay; Manufacturer Part Number: CRCW0402255KFKED
R60 = Resistor - 330K [0402]: Thick Film Resistors - SMD 1/16 W 330 KOhm 1%; Manufacturer Name: Vishay; Manufacturer Part Number: CRCW0402330KFKED; ComponentLink1Description: DataSheet; ComponentLink1URL: https://www.mouser.com.tr/datasheet/2/427/dcrcwe3-1762152.pdf; ComponentLink2Description: Mouser; ComponentLink2URL: https://www.mouser.com.tr/ProductDetail/Vishay-Dale/CRCW040210K0FKED?qs=sGAEpiMZZMu61qfTUdNhG2DpbjADlD3GcalbOv9utCY%3D
R61 R64 = Resistor - 100K [0402]: Thick Film Resistors - SMD 1/16 W 100 KOhm 1%; Manufacturer Name: Vishay; Manufacturer Part Number: CRCW0402100KFKED; ComponentLink1Description: DataSheet; ComponentLink1URL: https://www.mouser.com.tr/datasheet/2/427/dcrcwe3-1762152.pdf; ComponentLink2Description: Mouser; ComponentLink2URL: https://www.mouser.com.tr/ProductDetail/Vishay-Dale/CRCW040210K0FKED?qs=sGAEpiMZZMu61qfTUdNhG2DpbjADlD3GcalbOv9utCY%3D
R62 = Resistor - 17K4 [0402]: Thick Film Resistors - SMD 1/16 W 17.4 KOhm 1%; Manufacturer Name: Vishay; Manufacturer Part Number: CRCW040217K4FKED; ComponentLink1Description: DataSheet; ComponentLink1URL: https://www.mouser.com.tr/datasheet/2/427/dcrcwe3-1762152.pdf; ComponentLink2Description: Mouser; ComponentLink2URL: https://www.mouser.com.tr/ProductDetail/Vishay-Dale/CRCW040210K0FKED?qs=sGAEpiMZZMu61qfTUdNhG2DpbjADlD3GcalbOv9utCY%3D
TP2 = PCB - Test Point: Test Point
U16 = IC - TPS61088: Switching Voltage Regulators 10-A Fully-Integrated Synchronous Boost Converter 20-VQFN -40 to 85; Case: VQFN-20; Manufacturer Part Number: TPS61088RHLR

## Sheet Power 3V3 Regulator.SchDoc: 3V3 LDO Regulator
size 292 x 193 mm; SheetNumber: 7; SheetTotal: 40
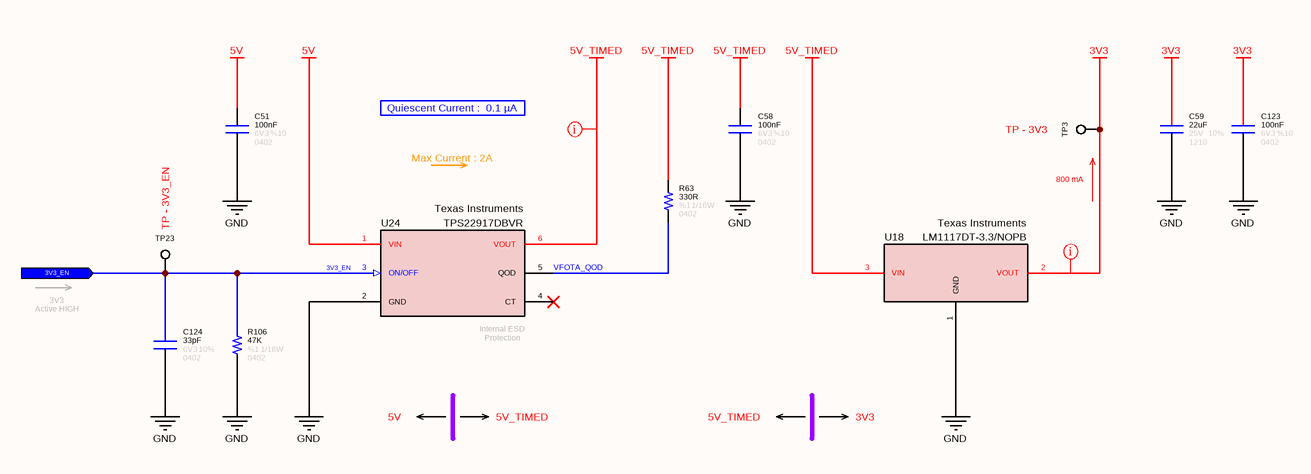
[diagram p20: Power 3V3 Regulator.SchDoc]

### Parts
C51  value 100nF  Tolerance: %10  Voltage: 6V3  Case: 0402  [CAPACITOR_0402]  (hidden comment: Capacitor - 100nF [0402] (Ceramic))
C58  value 100nF  Tolerance: %10  Voltage: 6V3  Case: 0402  [CAPACITOR_0402]  (hidden comment: Capacitor - 100nF [0402] (Ceramic))
C59  value 22uF  Tolerance: 10%  Case: 1210  Voltage: 25V  [CAPACITOR_0603]  (hidden comment: Capacitor - 22uF [1210] (Ceramic))
C123  value 100nF  Tolerance: %10  Voltage: 6V3  Case: 0402  [CAPACITOR_0402]  (hidden comment: Capacitor - 100nF [0402] (Ceramic))
C124  value 33pF  Tolerance: 10%  Case: 0402  Voltage: 6V3  [CAPACITOR_0402]  (hidden comment: Capacitor - 33pF [0402] (Ceramic))
R63  value 330R  Case: 0402  Tolerance: %1  Power: 1/16W  [RESISTOR_0402]  (hidden comment: 330R - 0402 - %1 - 1/16W)
R106  value 47K  Tolerance: %1  Case: 0402  Power: 1/16W  [RESISTOR_0402]  (hidden comment: 47K - 0402 - %1 - 1/16W)
TP3  TP - 3V3  [TP]  (no BOM)
TP23  TP - 3V3_EN  [TP]  (no BOM)
U18  Manufacturer Part Number: LM1117DT-3.3/NOPB  Manufacturer Name: Texas Instruments  [TO-252]  (hidden comment: LDO Regulator)
U24  Manufacturer Part Number: TPS22917DBVR  Manufacturer Name: Texas Instruments  [SOT-23-6]  (hidden comment: Power Switch)

### Ports
3V3_EN (in)

### Nets
3V3: C59.2 C123.2 TP3.1 U18.2(VOUT)
5V: C51.2 U24.1(VIN)
5V_TIMED: C58.2 R63.2 U18.3(VIN) U24.6(VOUT)
GND: C51.1 C58.1 C59.1 C123.1 C124.1 R106.1 U18.1(GND) U24.2(GND)
3V3_EN: C124.2 R106.2 TP23.1 U24.3(ON/OFF) ; port 3V3_EN
VFOTA_QOD: R63.1 U24.5(QOD)

Not connected (* = marked no-connect by the designer): U24 4(CT)*

### Layout directives
rule Supply Nets [Voltage = 3.300]: 3V3
rule Supply Nets [Voltage = 5.170]: 5V_TIMED

### Notes on the sheet
- Quiescent Current :  0.1 µA
- Max Current : 2A
- (near TP3) 800 mA
- 3V3
  Active HIGH
- (near U24) Internal ESD Protection
- 5V
- 5V_TIMED
- 3V3
- © 2021 All rights reserved.
  This document may not, in whole or in part, be copied, photocopied, reproduced, translated or converted to any electronic or machine readable from without prior written permission of Mehmet Günce Akkoyun.
  Engineer contact : akkoyun@me.com
- Property of
- Engineer :
- Date :
- Size :
- A4
- Time :
- Project :
- Page :
- /
- Customer :
- Product ID :
- Module ID :
- Version :
- File :
- Revision :

### Library data of the parts
C51 C58 C123 = Capacitor - 100nF [0402-6V3]: as C44 on sheet Power 5V Boost Converter; ComponentLink1Description: Mouser; ComponentLink1URL: https://www.mouser.com.tr/ProductDetail/AVX/04026D104KAT4A?qs=sGAEpiMZZMs0AnBnWHyRQPg4iYkCw7IMED%2F4kpqgf7w%3D; ComponentLink2Description: DataSheet; ComponentLink2URL: https://www.mouser.com.tr/datasheet/2/40/cx5r-776519.pdf
C59 = Capacitor - 22uF [1210-6V3]: as C42 on sheet Power 5V Boost Converter
C124 = Capacitor - 33pF [0402-6V3]: Manufacturer Name: Kemet; Manufacturer Part Number: C0402C330J9RACAUTO; ComponentLink1Description: DataSheet; ComponentLink1URL: https://api.kemet.com/component-edge/download/datasheet/C0402C330J9RACAUTO.pdf; ComponentLink2Description: Mouser; ComponentLink2URL: https://www.mouser.com/Search/Refine.aspx?Keyword=80-C0402C330J9RAUTO
R63 = Resistor - 330R [0402]: Thick Film Resistors - SMD 1/16 W 330 Ohm 1%; Manufacturer Name: Vishay; Manufacturer Part Number: CRCW0402330RFKED; ComponentLink1Description: DataSheet; ComponentLink1URL: https://www.mouser.com.tr/datasheet/2/427/dcrcwe3-1762152.pdf; ComponentLink2Description: Mouser; ComponentLink2URL: https://www.mouser.com.tr/ProductDetail/Vishay-Dale/CRCW0402330RFKED?qs=sGAEpiMZZMu61qfTUdNhG2DpbjADlD3GGS6SwBlLi5Q%3D
R106 = Resistor - 47K [0402]: Thick Film Resistors - SMD 1/16 W 47 KOhm 1%; Manufacturer Name: Vishay; Manufacturer Part Number: CRCW040247K0FKED; ComponentLink1Description: DataSheet; ComponentLink1URL: https://www.mouser.com.tr/datasheet/2/427/dcrcwe3-1762152.pdf; ComponentLink2Description: Mouser; ComponentLink2URL: https://www.mouser.com.tr/ProductDetail/Vishay-Dale/CRCW040247K0FKED?qs=sGAEpiMZZMu61qfTUdNhG2DpbjADlD3GL%252B3h1elTxqU%3D
TP3 TP23 = PCB - Test Point: Test Point
U18 = IC - LM1117DT-3.3/NOPB: LDO Voltage Regulators 800MA LDO LINEAR REG; Case: TO-252-3
U24 = IC - TPS22917: Power Switch MosFet; Height: 1.45mm; ComponentLink1Description: DataSheet; ComponentLink1URL: http://www.ti.com/lit/gpn/tps22917; ComponentLink2Description: Mouser; ComponentLink2URL: https://www.mouser.com/Search/Refine.aspx?Keyword=595-TPS22917DBVR; Case: SOT-23-6

## Sheet Power Sleep Timer.SchDoc: Sleep Timer
size 292 x 193 mm; SheetNumber: 6; SheetTotal: 40
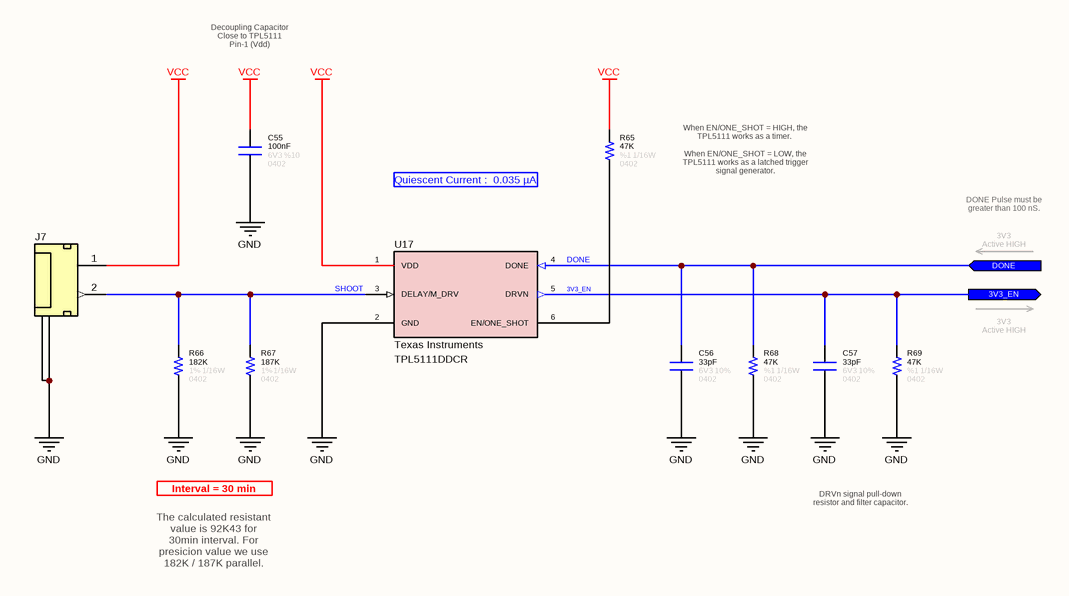
[diagram p21: Power Sleep Timer.SchDoc]

### Parts
C55  value 100nF  Tolerance: %10  Voltage: 6V3  Case: 0402  [CAPACITOR_0402]  (hidden comment: Capacitor - 100nF [0402] (Ceramic))
C56  value 33pF  Tolerance: 10%  Case: 0402  Voltage: 6V3  [CAPACITOR_0402]  (hidden comment: Capacitor - 33pF [0402] (Ceramic))
C57  value 33pF  Tolerance: 10%  Case: 0402  Voltage: 6V3  [CAPACITOR_0402]  (hidden comment: Capacitor - 33pF [0402] (Ceramic))
J7  2P SMD Tunic Connector  [Connector_Tunic 2P]  (value not drawn)
R65  value 47K  Tolerance: %1  Case: 0402  Power: 1/16W  [RESISTOR_0402]  (hidden comment: 47K - 0402 - %1 - 1/16W)
R66  value 182K  Power: 1/16W  Case: 0402  Tolerance: 1%  [RESISTOR_0402]  (hidden comment: 182K - 0402 - %1 - 1/16W)
R67  value 187K  Power: 1/16W  Case: 0402  Tolerance: 1%  [RESISTOR_0402]  (hidden comment: 187K - 0402 - %1 - 1/16W)
R68  value 47K  Tolerance: %1  Case: 0402  Power: 1/16W  [RESISTOR_0402]  (hidden comment: 47K - 0402 - %1 - 1/16W)
R69  value 47K  Tolerance: %1  Case: 0402  Power: 1/16W  [RESISTOR_0402]  (hidden comment: 47K - 0402 - %1 - 1/16W)
U17  Manufacturer Name: Texas Instruments  [SOT-23-6]  (hidden comment: TPL5111DDCR)

### Ports
3V3_EN (out), DONE (in)

### Nets
GND: C55.1 C56.1 C57.1 J7.3(GND) J7.4(GND) R66.1 R67.1 R68.1 R69.1 U17.2(GND)
VCC: C55.2 J7.1(Pin1) R65.2 U17.1(VDD)
3V3_EN: C57.2 R69.2 U17.5(DRVN) ; port 3V3_EN
DONE: C56.2 R68.2 U17.4(DONE) ; port DONE
SHOOT: J7.2(Pin2) R66.2 R67.2 U17.3(DELAY/M_DRV)
NetR65_1: R65.1 U17.6(EN/ONE_SHOT)

### Notes on the sheet
- Decoupling Capacitor
  Close to TPL5111
  Pin-1 (Vdd)
- Quiescent Current :  0.035 µA
- When EN/ONE_SHOT = HIGH, the TPL5111 works as a timer.
  When EN/ONE_SHOT = LOW, the TPL5111 works as a latched trigger signal generator.
- DONE Pulse must be greater than 100 nS.
- 3V3
  Active HIGH
- Interval = 30 min
- DRVn signal pull-down resistor and filter capacitor.
- The calculated resistant value is 92K43 for 30min interval. For presicion value we use 182K / 187K parallel.
- © 2021 All rights reserved.
  This document may not, in whole or in part, be copied, photocopied, reproduced, translated or converted to any electronic or machine readable from without prior written permission of Mehmet Günce Akkoyun.
  Engineer contact : akkoyun@me.com
- Property of
- Engineer :
- Date :
- Size :
- A4
- Time :
- Project :
- Page :
- /
- Customer :
- Product ID :
- Module ID :
- Version :
- File :
- Revision :

### Library data of the parts
C55 = Capacitor - 100nF [0402-6V3]: as C44 on sheet Power 5V Boost Converter; ComponentLink1Description: Mouser; ComponentLink1URL: https://www.mouser.com.tr/ProductDetail/AVX/04026D104KAT4A?qs=sGAEpiMZZMs0AnBnWHyRQPg4iYkCw7IMED%2F4kpqgf7w%3D; ComponentLink2Description: DataSheet; ComponentLink2URL: https://www.mouser.com.tr/datasheet/2/40/cx5r-776519.pdf
C56 C57 = Capacitor - 33pF [0402-6V3]: as C124 on sheet Power 3V3 Regulator; ComponentLink1Description: DataSheet; ComponentLink1URL: https://api.kemet.com/component-edge/download/datasheet/C0402C330J9RACAUTO.pdf; ComponentLink2Description: Mouser; ComponentLink2URL: https://www.mouser.com/Search/Refine.aspx?Keyword=80-C0402C330J9RAUTO
J7 = Connector - Mini Tunic 2P (1.25): Mini Tunic Connector with 2P; Manufacturer Name: Molex; Manufacturer Part Number: 53261-0271; Height: 3.55mm; Mouser Part Number: 538-53261-0271; ROHS: Yes; System: Connector
R65 R68 R69 = Resistor - 47K [0402]: as R106 on sheet Power 3V3 Regulator; ComponentLink1Description: DataSheet; ComponentLink1URL: https://www.mouser.com.tr/datasheet/2/427/dcrcwe3-1762152.pdf; ComponentLink2Description: Mouser; ComponentLink2URL: https://www.mouser.com.tr/ProductDetail/Vishay-Dale/CRCW040247K0FKED?qs=sGAEpiMZZMu61qfTUdNhG2DpbjADlD3GL%252B3h1elTxqU%3D
R66 = Resistor - 182K [0402]: Thick Film Resistors - SMD 1/16 W 182 KOhm 1%; Manufacturer Name: Vishay; Manufacturer Part Number: CRCW0402182KFKEDC
R67 = Resistor - 187K [0402]: Thick Film Resistors - SMD 1/16 W 187 KOhm 1%; Manufacturer Name: Vishay; Manufacturer Part Number: CRCW0402182KFKEDC
U17 = IC - TPL5111: NANO-POWER SYSTEM TIMER FOR POWE; Maximum Operating Temperature: + 105 C; Minimum Operating Temperature: - 40 C; RoHS: Yes; Case: SOT-23-6; Product Type: Timers; Manufacturer Part Number: TPL5111DDCR

## Sheet GSM IoT Block Diagram.SchDoc: GSM IoT Block Diagram
size 292 x 193 mm; DocumentNumber: 9; SheetNumber: 24; SheetTotal: 38
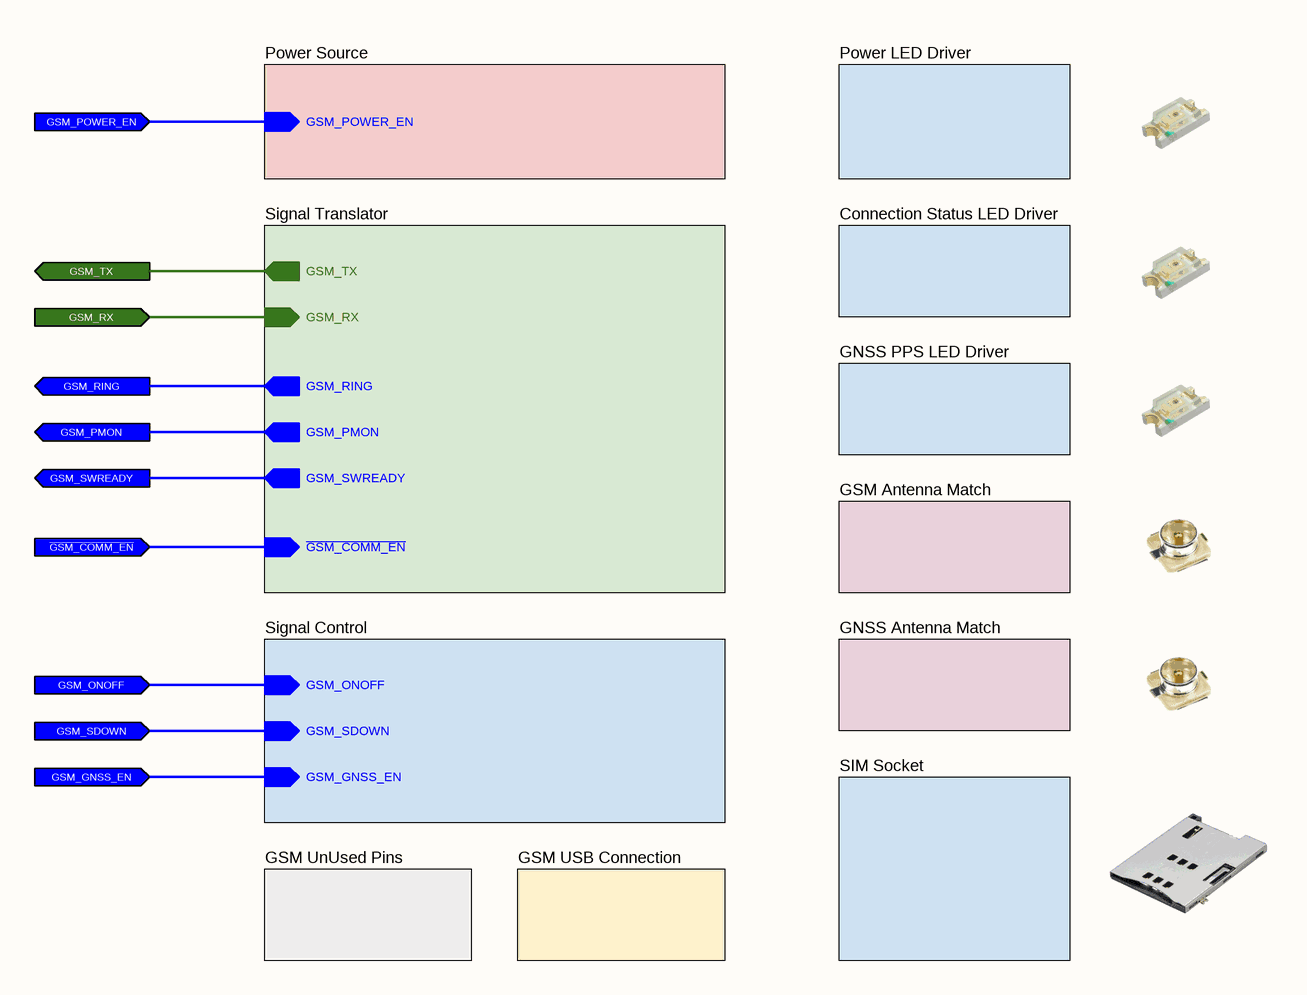
[diagram p22: GSM IoT Block Diagram.SchDoc]

### Sub-sheets
Connection Status LED Driver = GSM Status LED Driver.SchDoc: no entries
GNSS Antenna Match = GNSS Antenna.SchDoc: no entries
GNSS PPS LED Driver = GSM PPS LED Driver.SchDoc: no entries
GSM Antenna Match = GSM Modem Antenna.SchDoc: no entries
GSM UnUsed Pins = GSM UnUsed.SchDoc: no entries
GSM USB Connection = GSM USB Port.SchDoc: no entries
Power LED Driver = GSM Power LED Driver.SchDoc: no entries
Power Source = GSM Power Source.SchDoc: GSM_POWER_EN (in)
Signal Control = GSM Signal Block Diagram.SchDoc: GSM_ONOFF (in), GSM_SDOWN (in), GSM_GNSS_EN (in)
Signal Translator = GSM Voltage Translator.SchDoc: ~{GSM_COMM_EN} (in), GSM_RX (in), GSM_PMON (out), GSM_RING (out), GSM_TX (out), GSM_SWREADY (out)
SIM Socket = GSM SIM Socket.SchDoc: no entries

### Ports
GSM_GNSS_EN (in), GSM_ONOFF (in), GSM_PMON (out), GSM_POWER_EN (in), GSM_RING (out), GSM_RX (in), GSM_SDOWN (in), GSM_SWREADY (out), GSM_TX (out), ~{GSM_COMM_EN} (in)

### Nets
~{GSM_COMM_EN}: port ~{GSM_COMM_EN}, sheet Signal Translator/~{GSM_COMM_EN}
GSM_GNSS_EN: port GSM_GNSS_EN, sheet Signal Control/GSM_GNSS_EN
GSM_ONOFF: port GSM_ONOFF, sheet Signal Control/GSM_ONOFF
GSM_PMON: port GSM_PMON, sheet Signal Translator/GSM_PMON
GSM_POWER_EN: port GSM_POWER_EN, sheet Power Source/GSM_POWER_EN
GSM_RING: port GSM_RING, sheet Signal Translator/GSM_RING
GSM_RX: port GSM_RX, sheet Signal Translator/GSM_RX
GSM_SDOWN: port GSM_SDOWN, sheet Signal Control/GSM_SDOWN
GSM_SWREADY: port GSM_SWREADY, sheet Signal Translator/GSM_SWREADY
GSM_TX: port GSM_TX, sheet Signal Translator/GSM_TX

### Notes on the sheet
- © 2021 All rights reserved.
  This document may not, in whole or in part, be copied, photocopied, reproduced, translated or converted to any electronic or machine readable from without prior written permission of Mehmet Günce Akkoyun.
  Engineer contact : akkoyun@me.com
- Property of
- Engineer :
- Date :
- Size :
- A4
- Time :
- Project :
- Page :
- /
- Customer :
- Product ID :
- Module ID :
- Version :
- File :
- Revision :

## Sheet GSM Voltage Translator.SchDoc: 3V3 - 1V8 Voltage Level Translator
size 393 x 292 mm; DocumentNumber: 11; SheetNumber: 29; SheetTotal: 40
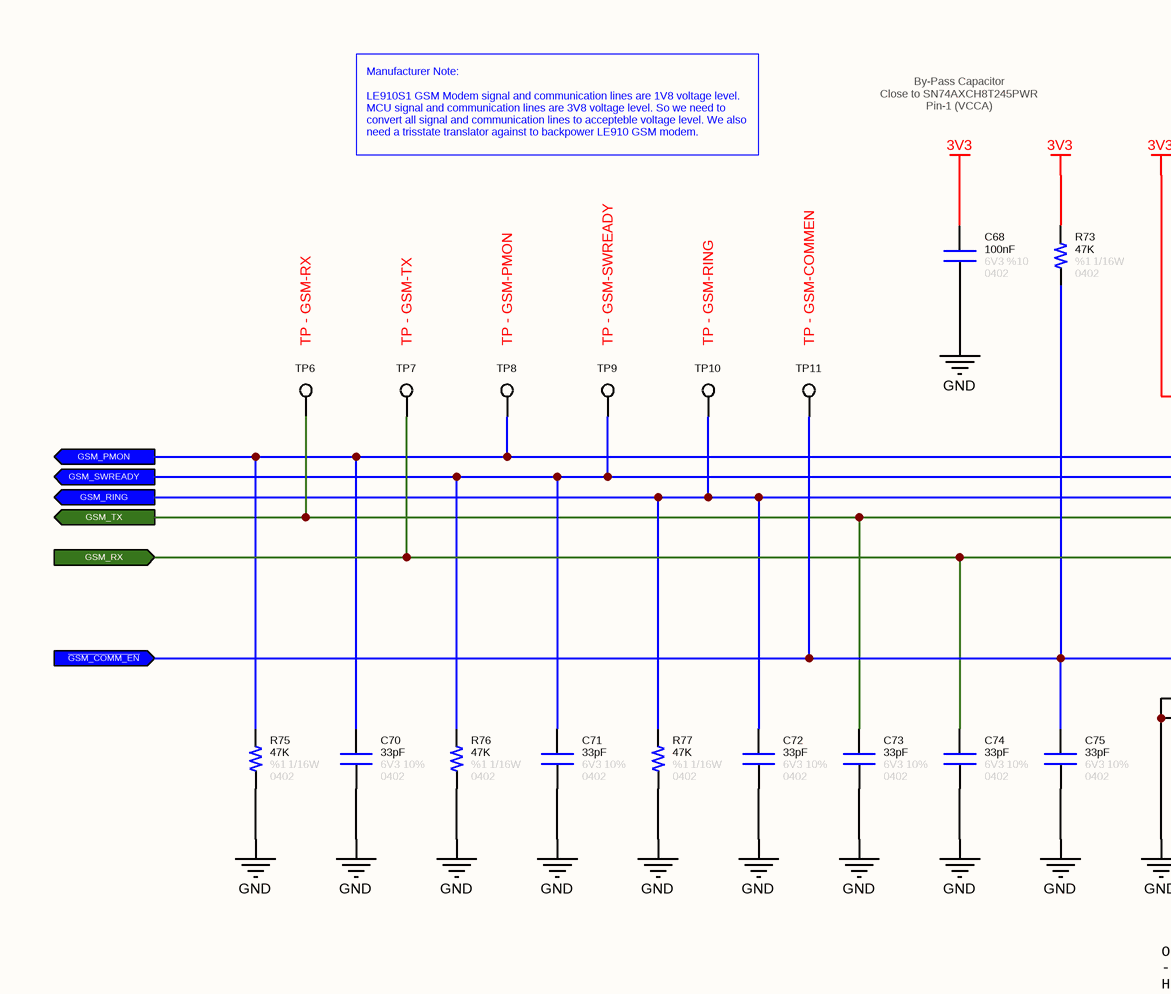
[diagram p23: GSM Voltage Translator.SchDoc, left]
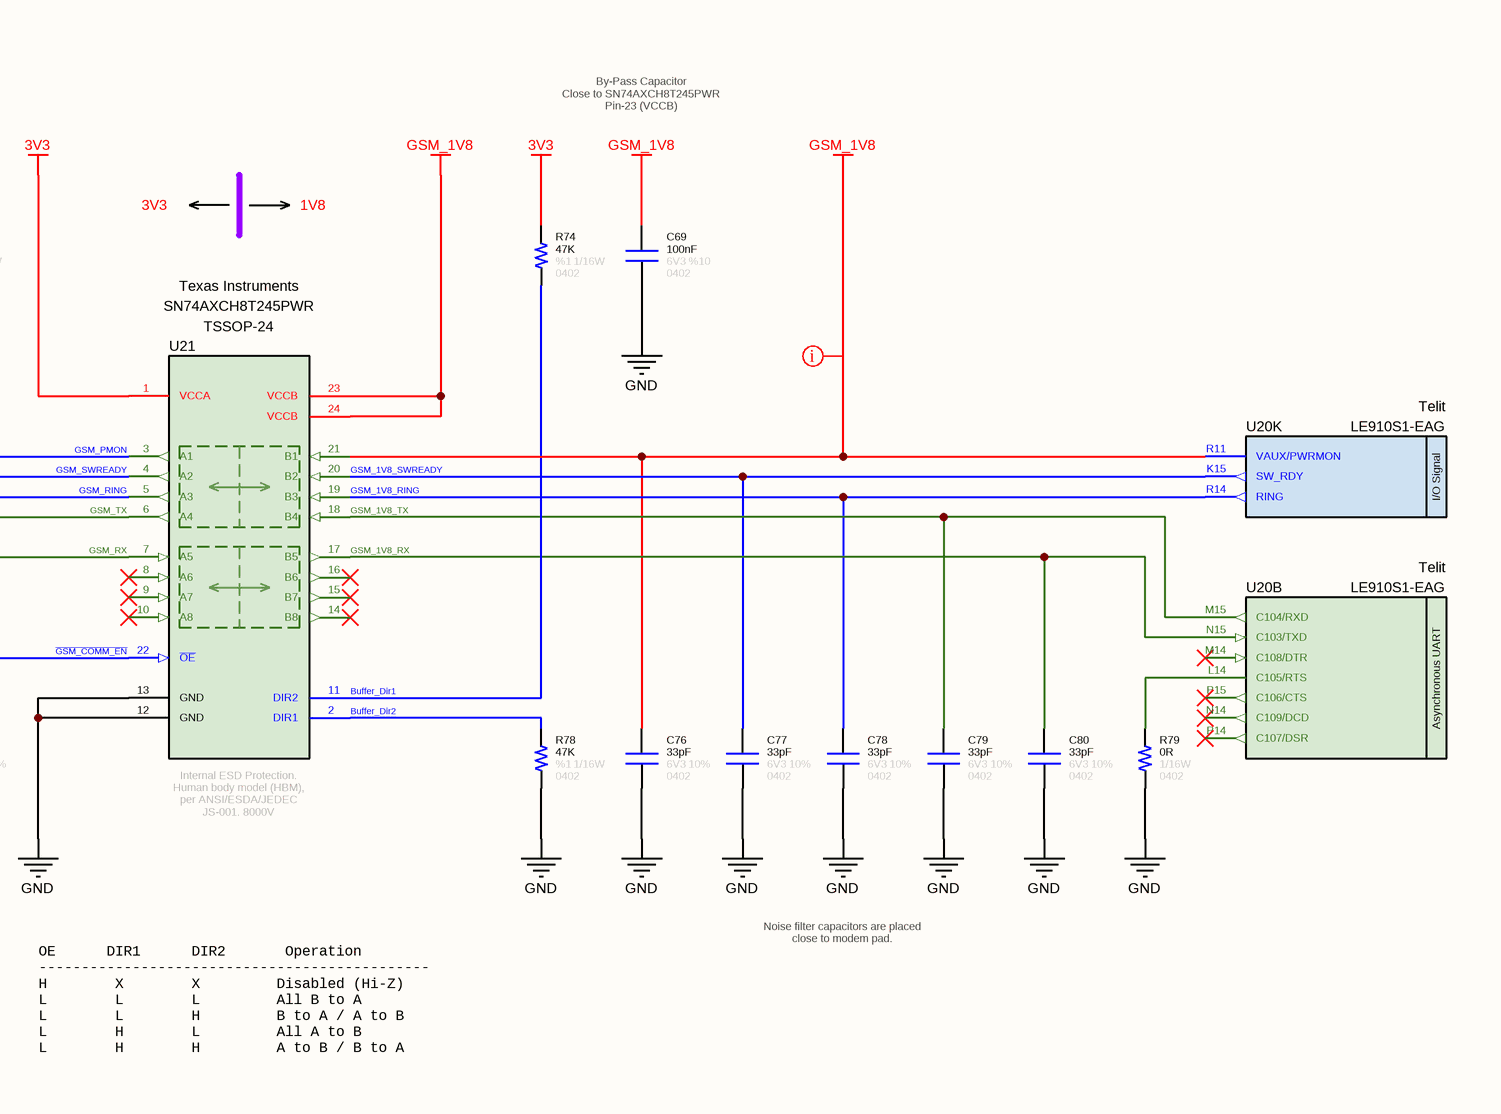
[diagram p24: GSM Voltage Translator.SchDoc, right]

### Parts
C68  value 100nF  Tolerance: %10  Voltage: 6V3  Case: 0402  [CAPACITOR_0402]  (hidden comment: Capacitor - 100nF [0402] (Ceramic))
C69  value 100nF  Tolerance: %10  Voltage: 6V3  Case: 0402  [CAPACITOR_0402]  (hidden comment: Capacitor - 100nF [0402] (Ceramic))
C70  value 33pF  Tolerance: 10%  Case: 0402  Voltage: 6V3  [CAPACITOR_0402]  (hidden comment: Capacitor - 33pF [0402] (Ceramic))
C71  value 33pF  Tolerance: 10%  Case: 0402  Voltage: 6V3  [CAPACITOR_0402]  (hidden comment: Capacitor - 33pF [0402] (Ceramic))
C72  value 33pF  Tolerance: 10%  Case: 0402  Voltage: 6V3  [CAPACITOR_0402]  (hidden comment: Capacitor - 33pF [0402] (Ceramic))
C73  value 33pF  Tolerance: 10%  Case: 0402  Voltage: 6V3  [CAPACITOR_0402]  (hidden comment: Capacitor - 33pF [0402] (Ceramic))
C74  value 33pF  Tolerance: 10%  Case: 0402  Voltage: 6V3  [CAPACITOR_0402]  (hidden comment: Capacitor - 33pF [0402] (Ceramic))
C75  value 33pF  Tolerance: 10%  Case: 0402  Voltage: 6V3  [CAPACITOR_0402]  (hidden comment: Capacitor - 33pF [0402] (Ceramic))
C76  value 33pF  Tolerance: 10%  Case: 0402  Voltage: 6V3  [CAPACITOR_0402]  (hidden comment: Capacitor - 33pF [0402] (Ceramic))
C77  value 33pF  Tolerance: 10%  Case: 0402  Voltage: 6V3  [CAPACITOR_0402]  (hidden comment: Capacitor - 33pF [0402] (Ceramic))
C78  value 33pF  Tolerance: 10%  Case: 0402  Voltage: 6V3  [CAPACITOR_0402]  (hidden comment: Capacitor - 33pF [0402] (Ceramic))
C79  value 33pF  Tolerance: 10%  Case: 0402  Voltage: 6V3  [CAPACITOR_0402]  (hidden comment: Capacitor - 33pF [0402] (Ceramic))
C80  value 33pF  Tolerance: 10%  Case: 0402  Voltage: 6V3  [CAPACITOR_0402]  (hidden comment: Capacitor - 33pF [0402] (Ceramic))
R73  value 47K  Tolerance: %1  Case: 0402  Power: 1/16W  [RESISTOR_0402]  (hidden comment: 47K - 0402 - %1 - 1/16W)
R74  value 47K  Tolerance: %1  Case: 0402  Power: 1/16W  [RESISTOR_0402]  (hidden comment: 47K - 0402 - %1 - 1/16W)
R75  value 47K  Tolerance: %1  Case: 0402  Power: 1/16W  [RESISTOR_0402]  (hidden comment: 47K - 0402 - %1 - 1/16W)
R76  value 47K  Tolerance: %1  Case: 0402  Power: 1/16W  [RESISTOR_0402]  (hidden comment: 47K - 0402 - %1 - 1/16W)
R77  value 47K  Tolerance: %1  Case: 0402  Power: 1/16W  [RESISTOR_0402]  (hidden comment: 47K - 0402 - %1 - 1/16W)
R78  value 47K  Tolerance: %1  Case: 0402  Power: 1/16W  [RESISTOR_0402]  (hidden comment: 47K - 0402 - %1 - 1/16W)
R79  value 0R  Case: 0402  Power: 1/16W  [RESISTOR_0402]  (hidden comment: 0R - 0402 - %1 - 1/16W)
TP6  TP - GSM-RX  [TP]  (no BOM)
TP7  TP - GSM-TX  [TP]  (no BOM)
TP8  TP - GSM-PMON  [TP]  (no BOM)
TP9  TP - GSM-SWREADY  [TP]  (no BOM)
TP10  TP - GSM-RING  [TP]  (no BOM)
TP11  TP - GSM-COMMEN  [TP]  (no BOM)
U20  Manufacturer Part Number: LE910S1-EAG  Manufacturer Name: Telit  [LE910 GSM Modem]  (hidden comment: LE910S1-EAG LTE GSM Module)  (parts B,K of 19)
U21  Manufacturer Name: Texas Instruments  [TSSOP-24]  (hidden comment: SN74AXCH8T245PWR)

### Ports
GSM_PMON (out), GSM_RING (out), GSM_RX (in), GSM_SWREADY (out), GSM_TX (out), ~{GSM_COMM_EN} (in)

### Nets
3V3: C68.2 R73.2 R74.2 U21.1(VCCA)
GND: C68.1 C69.1 C70.1 C71.1 C72.1 C73.1 C74.1 C75.1 C76.1 C77.1 C78.1 C79.1 C80.1 R75.1 R76.1 R77.1 R78.1 R79.1 U21.12(GND) U21.13(GND)
GSM_1V8: C69.2 C76.2 U20.R11(VAUX/PWRMON) U21.21(B1) U21.23(VCCB) U21.24(VCCB)
Buffer_Dir1: R74.1 U21.11(DIR2)
Buffer_Dir2: R78.2 U21.2(DIR1)
~{GSM_COMM_EN}: C75.2 R73.1 TP11.1 U21.22(~{OE}) ; port ~{GSM_COMM_EN}
GSM_1V8_RING: C78.2 U20.R14(RING) U21.19(B3)
GSM_1V8_RX: C80.2 U20.N15(C103/TXD) U21.17(B5)
GSM_1V8_SWREADY: C77.2 U20.K15(SW_RDY) U21.20(B2)
GSM_1V8_TX: C79.2 U20.M15(C104/RXD) U21.18(B4)
GSM_PMON: C70.2 R75.2 TP8.1 U21.3(A1) ; port GSM_PMON
GSM_RING: C72.2 R77.2 TP10.1 U21.5(A3) ; port GSM_RING
GSM_RX: C74.2 TP7.1 U21.7(A5) ; port GSM_RX
GSM_SWREADY: C71.2 R76.2 TP9.1 U21.4(A2) ; port GSM_SWREADY
GSM_TX: C73.2 TP6.1 U21.6(A4) ; port GSM_TX
NetR79_2: R79.2 U20.L14(C105/RTS)

Not connected (* = marked no-connect by the designer): U20 M14(C108/DTR)* N14(C109/DCD)* P14(C107/DSR)* P15(C106/CTS)*; U21 8(A6)* 9(A7)* 10(A8)* 14(B8)* 15(B7)* 16(B6)*

### Layout directives
rule Supply Nets [Voltage = 1.800]: GSM_1V8

### Notes on the sheet
- Manufacturer Note:
  LE910S1 GSM Modem signal and communication lines are 1V8 voltage level.  MCU signal and communication lines are 3V8 voltage level. So we need to convert all signal and communication lines to accepteble voltage level. We also need a trisstate translator against to backpower LE910 GSM modem.
- By-Pass Capacitor
  Close to SN74AXCH8T245PWR
  Pin-1 (VCCA)
- By-Pass Capacitor
  Close to SN74AXCH8T245PWR
  Pin-23 (VCCB)
- 3V3
- 1V8
- Noise filter capacitors are placed close to modem pad.
- OE      DIR1      DIR2       Operation
  ----------------------------------------------
  H        X        X         Disabled (Hi-Z)
  L        L        L         All B to A
  L        L        H         B to A / A to B
  L        H        L         All A to B
  L        H        H         A to B / B to A
- © 2021 All rights reserved.
  This document may not, in whole or in part, be copied, photocopied, reproduced, translated or converted to any electronic or machine readable from without prior written permission of Mehmet Günce Akkoyun.
  Engineer contact : akkoyun@me.com
- Property of
- Engineer :
- Date :
- Size :
- A4
- Time :
- Project :
- Page :
- /
- Customer :
- Product ID :
- Module ID :
- Version :
- File :
- Revision :
- (in symbol IC - LE910S1-EAG, part B) Asynchronous UART
- (in symbol IC - LE910S1-EAG, part K) I/O Signal
- (in symbol IC - SN74AXCH8T245PWR) Internal ESD Protection. / Human body model (HBM), per ANSI/ESDA/JEDEC JS-001. 8000V

### Library data of the parts
C68 C69 = Capacitor - 100nF [0402-6V3]: as C44 on sheet Power 5V Boost Converter; ComponentLink1Description: Mouser; ComponentLink1URL: https://www.mouser.com.tr/ProductDetail/AVX/04026D104KAT4A?qs=sGAEpiMZZMs0AnBnWHyRQPg4iYkCw7IMED%2F4kpqgf7w%3D; ComponentLink2Description: DataSheet; ComponentLink2URL: https://www.mouser.com.tr/datasheet/2/40/cx5r-776519.pdf
C70-C80 = Capacitor - 33pF [0402-6V3]: as C124 on sheet Power 3V3 Regulator; ComponentLink1Description: DataSheet; ComponentLink1URL: https://api.kemet.com/component-edge/download/datasheet/C0402C330J9RACAUTO.pdf; ComponentLink2Description: Mouser; ComponentLink2URL: https://www.mouser.com/Search/Refine.aspx?Keyword=80-C0402C330J9RAUTO
R73-R78 = Resistor - 47K [0402]: as R106 on sheet Power 3V3 Regulator; ComponentLink1Description: DataSheet; ComponentLink1URL: https://www.mouser.com.tr/datasheet/2/427/dcrcwe3-1762152.pdf; ComponentLink2Description: Mouser; ComponentLink2URL: https://www.mouser.com.tr/ProductDetail/Vishay-Dale/CRCW040247K0FKED?qs=sGAEpiMZZMu61qfTUdNhG2DpbjADlD3GL%252B3h1elTxqU%3D
R79 = Resistor - 0R [0402]: Thick Film Resistors - SMD 1/16 W 0 Ohm; Manufacturer Name: Vishay; Manufacturer Part Number: CRCW04020000Z0ED; ComponentLink1Description: DataSheet; ComponentLink1URL: https://www.mouser.com.tr/datasheet/2/427/dcrcwe3-1762152.pdf; ComponentLink2Description: Mouser; ComponentLink2URL: https://www.mouser.com.tr/ProductDetail/Vishay-Dale/CRCW04020000Z0ED?qs=sGAEpiMZZMu61qfTUdNhG2DpbjADlD3GG34cJb50zyg%3D
TP6-TP11 = PCB - Test Point: Test Point
U20 = IC - LE910S1-EAG: Telit LE910S1-EAG GPRS/GNSS Module; Case: BGA
U21 = IC - SN74AXCH8T245PWR: Translation - Voltage Levels 8-Bit Dual-Supply Bus Transceiver 24-TSSOP -40 to 125; Number of Channels: 8 Channel; Logic Family: AXC; Data Rate: 380Mbps; Channel Type: Bidirectional; Supply Voltage - Min: 0V65; Supply Voltage - Max: 3V6; Output Type: Tri-State, Non-Inverted; Operating Supply Current: 60 uA; Propagation Delay Time: 4 ns; ROHS: Yes; Minimum Operating Temperature: - 40 C; Product Type: Translation - Voltage Levels; Maximum Operating Temperature: + 125 C; Manufacturer Part Number: SN74AXCH8T245PWR; Case: TSSOP-24